# EAGLE design 20230322 (EAGLE 6.6.0)

## Sheet 1 of 4
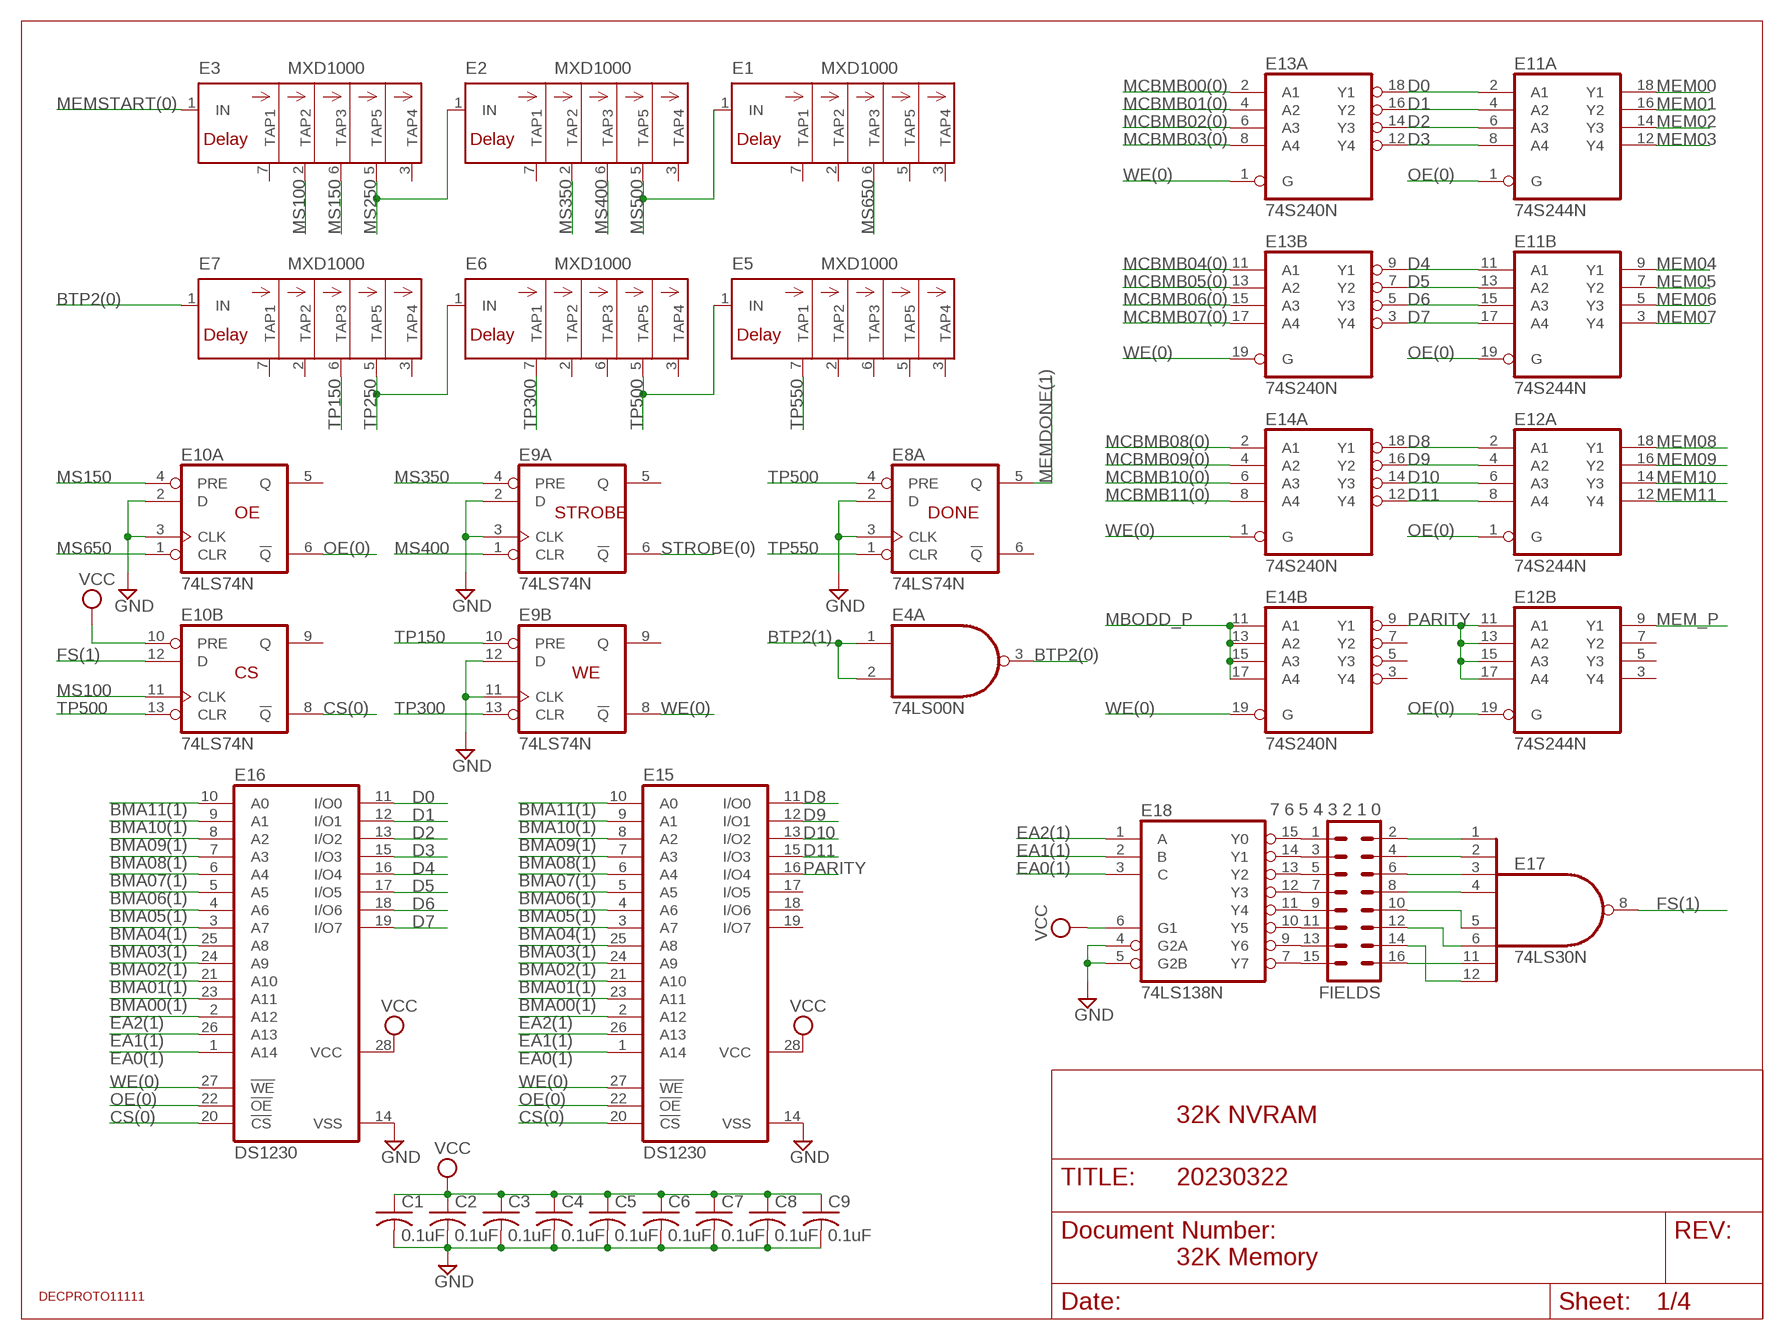
[diagram p0: schematic, sheet 1]

### Parts
C1  0.1uF  C-US050-025X075  [C050-025X075]
C2  0.1uF  C-US050-025X075  [C050-025X075]
C3  0.1uF  C-US050-025X075  [C050-025X075]
C4  0.1uF  C-US050-025X075  [C050-025X075]
C5  0.1uF  C-US050-025X075  [C050-025X075]
C6  0.1uF  C-US050-025X075  [C050-025X075]
C7  0.1uF  C-US050-025X075  [C050-025X075]
C8  0.1uF  C-US050-025X075  [C050-025X075]
C9  0.1uF  C-US050-025X075  [C050-025X075]
E1  MXD1000  [DIL08]
E2  MXD1000  [DIL08]
E3  MXD1000  [DIL08]
E4  74LS00N  [DIL14]
E5  MXD1000  [DIL08]
E6  MXD1000  [DIL08]
E7  MXD1000  [DIL08]
E8  74LS74N  [DIL14]
E9  74LS74N  [DIL14]
E10  74LS74N  [DIL14]
E11  74S244N  [DIL20]
E12  74S244N  [DIL20]
E13  74S240N  [DIL20]
E14  74S240N  [DIL20]
E15  DS1230  62256P  [DIL28-6]
E16  DS1230  62256P  [DIL28-6]
E17  74LS30N  [DIL14]
E18  74LS138N  [DIL16]
FIELDS  7 6 5 4 3 2 1 0  MA08-2  [MA08-2]
U$6  DECPROTO11111  [DECPROTO11111]

### Nets
BMA00(1): E15.23(A11) E16.23(A11) ; also sheet 2,3
BMA01(1): E15.21(A10) E16.21(A10) ; also sheet 2,3
BMA02(1): E15.24(A9) E16.24(A9) ; also sheet 2,3
BMA03(1): E15.25(A8) E16.25(A8) ; also sheet 2,3
BMA04(1): E15.3(A7) E16.3(A7) ; also sheet 2,3
BMA05(1): E15.4(A6) E16.4(A6) ; also sheet 2,3
BMA06(1): E15.5(A5) E16.5(A5) ; also sheet 2,3
BMA07(1): E15.6(A4) E16.6(A4) ; also sheet 2,3
BMA08(1): E15.7(A3) E16.7(A3) ; also sheet 2,3
BMA09(1): E15.8(A2) E16.8(A2) ; also sheet 2,3
BMA10(1): E15.9(A1) E16.9(A1) ; also sheet 2,3
BMA11(1): E15.10(A0) E16.10(A0) ; also sheet 2,3
BTP2(0): E4.3(A:O) E7.1(IN)
BTP2(1): E4.1(A:I0) E4.2(A:I1) ; also sheet 2
CS(0): E10.8(B:!Q) E15.20(!CS) E16.20(!CS) ; also sheet 3
D0: E11.2(A:A1) E13.18(A:Y1) E16.11(I/O0) ; also sheet 3
D1: E11.4(A:A2) E13.16(A:Y2) E16.12(I/O1) ; also sheet 3
D2: E11.6(A:A3) E13.14(A:Y3) E16.13(I/O2) ; also sheet 3
D3: E11.8(A:A4) E13.12(A:Y4) E16.15(I/O3) ; also sheet 3
D4: E11.11(B:A1) E13.9(B:Y1) E16.16(I/O4) ; also sheet 3
D5: E11.13(B:A2) E13.7(B:Y2) E16.17(I/O5) ; also sheet 3
D6: E11.15(B:A3) E13.5(B:Y3) E16.18(I/O6) ; also sheet 3
D7: E11.17(B:A4) E13.3(B:Y4) E16.19(I/O7) ; also sheet 3
D8: E12.2(A:A1) E14.18(A:Y1) E15.11(I/O0) ; also sheet 3
D9: E12.4(A:A2) E14.16(A:Y2) E15.12(I/O1) ; also sheet 3
D10: E12.6(A:A3) E14.14(A:Y3) E15.13(I/O2) ; also sheet 3
D11: E12.8(A:A4) E14.12(A:Y4) E15.15(I/O3) ; also sheet 3
EA0(1): E15.1(A14) E16.1(A14) E18.3(C) ; also sheet 2,3
EA1(1): E15.26(A13) E16.26(A13) E18.2(B) ; also sheet 2,3
EA2(1): E15.2(A12) E16.2(A12) E18.1(A) ; also sheet 2,3
FS(1): E10.12(B:D) E17.8(O) ; also sheet 3
GND [supply]: C1.2 C2.2 C3.2 C4.2 C5.2 C6.2 C7.2 C8.2 C9.2 E8.2(A:D) E8.3(A:CLK) E9.2(A:D) E9.3(A:CLK) E9.11(B:CLK) E9.12(B:D) E10.2(A:D) E10.3(A:CLK) E15.14(VSS) E16.14(VSS) E18.4(G2A) E18.5(G2B) ; also sheet 2,3
MBODD_P: E14.11(B:A1) E14.13(B:A2) E14.15(B:A3) E14.17(B:A4) ; also sheet 2,3
MCBMB00(0): E13.2(A:A1) ; also sheet 2,3
MCBMB01(0): E13.4(A:A2) ; also sheet 2,3
MCBMB02(0): E13.6(A:A3) ; also sheet 2,3
MCBMB03(0): E13.8(A:A4) ; also sheet 2
MCBMB04(0): E13.11(B:A1) ; also sheet 2
MCBMB05(0): E13.13(B:A2) ; also sheet 2
MCBMB06(0): E13.15(B:A3) ; also sheet 2
MCBMB07(0): E13.17(B:A4) ; also sheet 2
MCBMB08(0): E14.2(A:A1) ; also sheet 2
MCBMB09(0): E14.4(A:A2) ; also sheet 2
MCBMB10(0): E14.6(A:A3) ; also sheet 2
MCBMB11(0): E14.8(A:A4) ; also sheet 2
MEM00: E11.18(A:Y1) ; also sheet 2
MEM01: E11.16(A:Y2) ; also sheet 2
MEM02: E11.14(A:Y3) ; also sheet 2
MEM03: E11.12(A:Y4) ; also sheet 2
MEM04: E11.9(B:Y1) ; also sheet 2
MEM05: E11.7(B:Y2) ; also sheet 2
MEM06: E11.5(B:Y3) ; also sheet 2
MEM07: E11.3(B:Y4) ; also sheet 2
MEM08: E12.18(A:Y1) ; also sheet 2,3
MEM09: E12.16(A:Y2) ; also sheet 2,3
MEM10: E12.14(A:Y3) ; also sheet 2,3
MEM11: E12.12(A:Y4) ; also sheet 2,3
MEM_P: E12.9(B:Y1) ; also sheet 2
MEMDONE(1): E8.5(A:Q) ; also sheet 2
MEMSTART(0): E3.1(IN) ; also sheet 2
MS100: E3.2(TAP2) E10.11(B:CLK)
MS150: E3.6(TAP3) E10.4(A:PRE)
MS250: E2.1(IN) E3.5(TAP5)
MS350: E2.2(TAP2) E9.4(A:PRE)
MS400: E2.6(TAP3) E9.1(A:CLR)
MS500: E1.1(IN) E2.5(TAP5)
MS650: E1.6(TAP3) E10.1(A:CLR)
N$18: E18.15(Y0) FIELDS.1
N$19: E18.14(Y1) FIELDS.3
N$20: E18.13(Y2) FIELDS.5
N$21: E18.12(Y3) FIELDS.7
N$22: E18.11(Y4) FIELDS.9
N$23: E18.10(Y5) FIELDS.11
N$24: E18.9(Y6) FIELDS.13
N$25: E18.7(Y7) FIELDS.15
N$26: E17.4(I3) FIELDS.8
N$27: E17.3(I2) FIELDS.6
N$28: E17.2(I1) FIELDS.4
N$29: E17.1(I0) FIELDS.2
N$30: E17.5(I4) FIELDS.10
N$31: E17.6(I5) FIELDS.12
N$32: E17.12(I7) FIELDS.14
N$33: E17.11(I6) FIELDS.16
OE(0): E10.6(A:!Q) E11.1(A:G) E11.19(B:G) E12.1(A:G) E12.19(B:G) E15.22(!OE) E16.22(!OE) ; also sheet 3
PARITY: E12.11(B:A1) E12.13(B:A2) E12.15(B:A3) E12.17(B:A4) E14.9(B:Y1) E15.16(I/O4) ; also sheet 3
STROBE(0): E9.6(A:!Q) ; also sheet 2
TP150: E7.6(TAP3) E9.10(B:PRE)
TP250: E6.1(IN) E7.5(TAP5)
TP300: E6.7(TAP1) E9.13(B:CLR)
TP500: E5.1(IN) E6.5(TAP5) E8.4(A:PRE) E10.13(B:CLR)
TP550: E5.7(TAP1) E8.1(A:CLR)
VCC [supply]: C1.1 C2.1 C3.1 C4.1 C5.1 C6.1 C7.1 C8.1 C9.1 E10.10(B:PRE) E15.28(VCC) E16.28(VCC) E18.6(G1) ; also sheet 2
WE(0): E9.8(B:!Q) E13.1(A:G) E13.19(B:G) E14.1(A:G) E14.19(B:G) E15.27(!WE) E16.27(!WE) ; also sheet 3
Unconnected: E1.2(TAP2) E1.3(TAP4) E1.5(TAP5) E1.7(TAP1) E2.3(TAP4) E2.7(TAP1) E3.3(TAP4) E3.7(TAP1) E4.4(B:I0) E4.5(B:I1) E4.6(B:O) E4.8(C:O) E4.9(C:I0) E4.10(C:I1) E4.11(D:O) E4.12(D:I0) E4.13(D:I1) E5.2(TAP2) E5.3(TAP4) E5.5(TAP5) E5.6(TAP3) E6.2(TAP2) E6.3(TAP4) E6.6(TAP3) E7.2(TAP2) E7.3(TAP4) E7.7(TAP1) E8.6(A:!Q) E8.8(B:!Q) E8.9(B:Q) E8.10(B:PRE) E8.11(B:CLK) E8.12(B:D) E8.13(B:CLR) E9.5(A:Q) E9.9(B:Q) E10.5(A:Q) E10.9(B:Q) E12.3(B:Y4) E12.5(B:Y3) E12.7(B:Y2) E14.3(B:Y4) E14.5(B:Y3) E14.7(B:Y2) E15.17(I/O5) E15.18(I/O6) E15.19(I/O7)

### Notes on the sheet
- OE | STROBE | DONE
- CS | WE
- 32K NVRAM
- 32K Memory

## Sheet 2 of 4
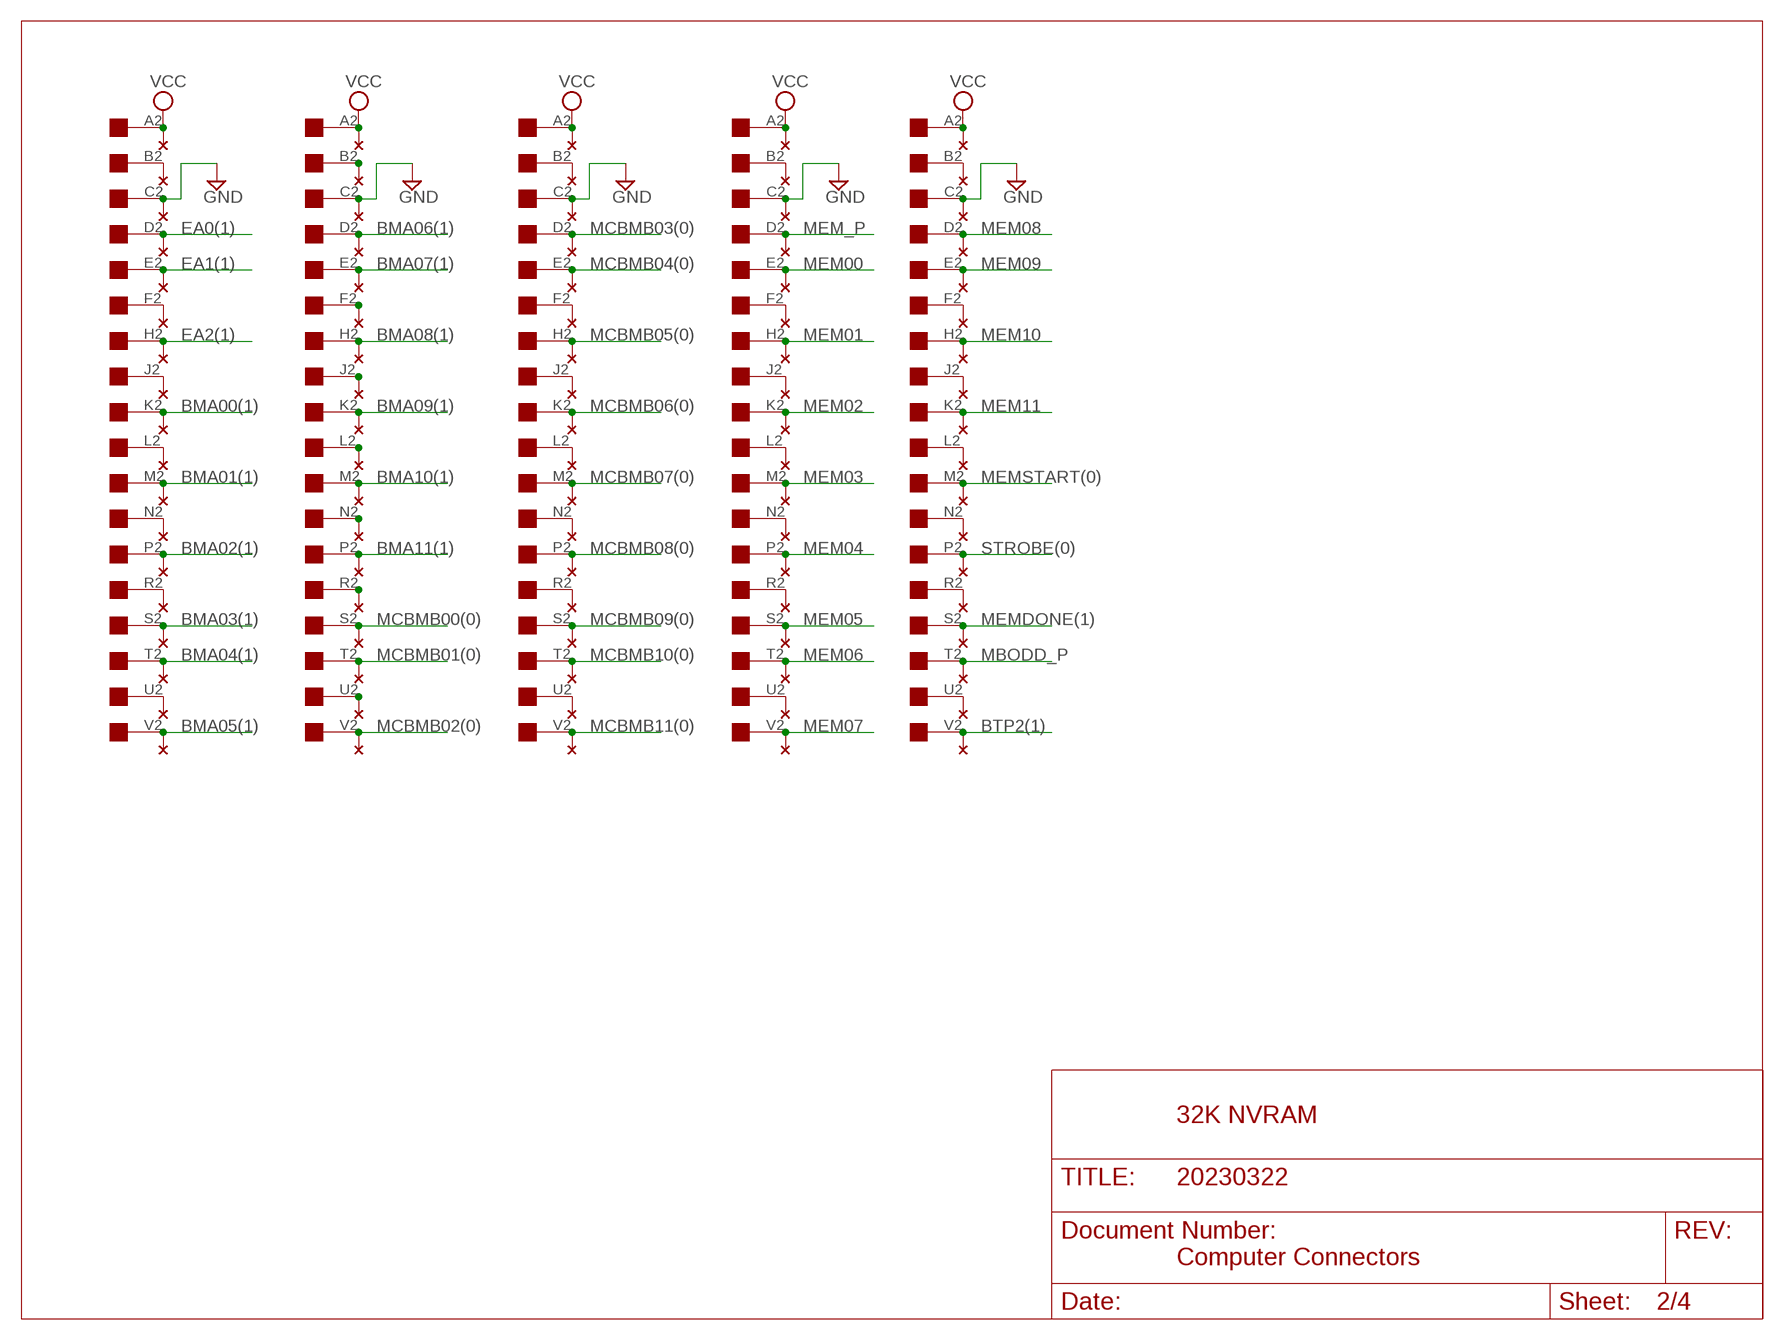
[diagram p1: schematic, sheet 2]

### Parts
H01  EDGE-1  [EDGE-CON1]
H02  EDGE-1  [EDGE-CON1]
H03  EDGE-1  [EDGE-CON1]
H04  EDGE-1  [EDGE-CON1]
H05  EDGE-1  [EDGE-CON1]
U$1  THRU-HOLE2  [THRU-HOLEB]
U$2  THRU-HOLE2  [THRU-HOLEB]
U$3  THRU-HOLE2  [THRU-HOLEB]
U$4  THRU-HOLE2  [THRU-HOLEB]
U$5  THRU-HOLE2  [THRU-HOLEB]

### Nets
BMA00(1): H01.K2 U$1.K2 ; also sheet 1,3
BMA01(1): H01.M2 U$1.M2 ; also sheet 1,3
BMA02(1): H01.P2 U$1.P2 ; also sheet 1,3
BMA03(1): H01.S2 U$1.S2 ; also sheet 1,3
BMA04(1): H01.T2 U$1.T2 ; also sheet 1,3
BMA05(1): H01.V2 U$1.V2 ; also sheet 1,3
BMA06(1): H02.D2 U$2.D2 ; also sheet 1,3
BMA07(1): H02.E2 U$2.E2 ; also sheet 1,3
BMA08(1): H02.H2 U$2.H2 ; also sheet 1,3
BMA09(1): H02.K2 U$2.K2 ; also sheet 1,3
BMA10(1): H02.M2 U$2.M2 ; also sheet 1,3
BMA11(1): H02.P2 U$2.P2 ; also sheet 1,3
BTP2(1): H05.V2 U$5.V2 ; also sheet 1
EA0(1): H01.D2 U$1.D2 ; also sheet 1,3
EA1(1): H01.E2 U$1.E2 ; also sheet 1,3
EA2(1): H01.H2 U$1.H2 ; also sheet 1,3
GND [supply]: H01.C2 H02.C2 H03.C2 H04.C2 H05.C2 U$1.C2 U$2.C2 U$3.C2 U$4.C2 U$5.C2 ; also sheet 1,3
MBODD_P: H05.T2 U$5.T2 ; also sheet 1,3
MCBMB00(0): H02.S2 U$2.S2 ; also sheet 1,3
MCBMB01(0): H02.T2 U$2.T2 ; also sheet 1,3
MCBMB02(0): H02.V2 U$2.V2 ; also sheet 1,3
MCBMB03(0): H03.D2 U$3.D2 ; also sheet 1
MCBMB04(0): H03.E2 U$3.E2 ; also sheet 1
MCBMB05(0): H03.H2 U$3.H2 ; also sheet 1
MCBMB06(0): H03.K2 U$3.K2 ; also sheet 1
MCBMB07(0): H03.M2 U$3.M2 ; also sheet 1
MCBMB08(0): H03.P2 U$3.P2 ; also sheet 1
MCBMB09(0): H03.S2 U$3.S2 ; also sheet 1
MCBMB10(0): H03.T2 U$3.T2 ; also sheet 1
MCBMB11(0): H03.V2 U$3.V2 ; also sheet 1
MEM00: H04.E2 U$4.E2 ; also sheet 1
MEM01: H04.H2 U$4.H2 ; also sheet 1
MEM02: H04.K2 U$4.K2 ; also sheet 1
MEM03: H04.M2 U$4.M2 ; also sheet 1
MEM04: H04.P2 U$4.P2 ; also sheet 1
MEM05: H04.S2 U$4.S2 ; also sheet 1
MEM06: H04.T2 U$4.T2 ; also sheet 1
MEM07: H04.V2 U$4.V2 ; also sheet 1
MEM08: H05.D2 U$5.D2 ; also sheet 1,3
MEM09: H05.E2 U$5.E2 ; also sheet 1,3
MEM10: H05.H2 U$5.H2 ; also sheet 1,3
MEM11: H05.K2 U$5.K2 ; also sheet 1,3
MEM_P: H04.D2 U$4.D2 ; also sheet 1
MEMDONE(1): H05.S2 U$5.S2 ; also sheet 1
MEMSTART(0): H05.M2 U$5.M2 ; also sheet 1
N$1: H01.L2 U$1.L2
N$3: H01.N2 U$1.N2
N$5: H01.R2 U$1.R2
N$7: H02.L2 U$2.L2
N$8: H02.N2 U$2.N2
N$9: H01.J2 U$1.J2
N$10: H02.R2 U$2.R2
N$11: H01.F2 U$1.F2
N$12: H02.J2 U$2.J2
N$13: H02.F2 U$2.F2
N$14: H02.U2 U$2.U2
N$15: H01.U2 U$1.U2
N$16: H02.B2 U$2.B2
N$17: H01.B2 U$1.B2
N$44: H04.J2 U$4.J2
N$45: H04.L2 U$4.L2
N$46: H04.N2 U$4.N2
N$57: H03.J2 U$3.J2
N$58: H03.L2 U$3.L2
N$59: H03.N2 U$3.N2
N$60: H03.F2 U$3.F2
N$61: H03.R2 U$3.R2
N$62: H03.B2 U$3.B2
N$63: H03.U2 U$3.U2
N$87: H05.J2 U$5.J2
N$88: H05.L2 U$5.L2
N$89: H05.N2 U$5.N2
N$90: H05.F2 U$5.F2
N$91: H05.R2 U$5.R2
N$92: H05.B2 U$5.B2
N$93: H05.U2 U$5.U2
N$112: H04.F2 U$4.F2
N$113: H04.R2 U$4.R2
N$114: H04.B2 U$4.B2
N$115: H04.U2 U$4.U2
STROBE(0): H05.P2 U$5.P2 ; also sheet 1
VCC [supply]: H01.A2 H02.A2 H03.A2 H04.A2 H05.A2 U$1.A2 U$2.A2 U$3.A2 U$4.A2 U$5.A2 ; also sheet 1
Unconnected: U$1.A1 U$1.B1 U$1.C1 U$1.D1 U$1.E1 U$1.F1 U$1.H1 U$1.J1 U$1.K1 U$1.L1 U$1.M1 U$1.N1 U$1.P1 U$1.R1 U$1.S1 U$1.T1 U$1.U1 U$1.V1 U$2.A1 U$2.B1 U$2.C1 U$2.D1 U$2.E1 U$2.F1 U$2.H1 U$2.J1 U$2.K1 U$2.L1 U$2.M1 U$2.N1 U$2.P1 U$2.R1 U$2.S1 U$2.T1 U$2.U1 U$2.V1 U$3.A1 U$3.B1 U$3.C1 U$3.D1 U$3.E1 U$3.F1 U$3.H1 U$3.J1 U$3.K1 U$3.L1 U$3.M1 U$3.N1 U$3.P1 U$3.R1 U$3.S1 U$3.T1 U$3.U1 U$3.V1 U$4.A1 U$4.B1 U$4.C1 U$4.D1 U$4.E1 U$4.F1 U$4.H1 U$4.J1 U$4.K1 U$4.L1 U$4.M1 U$4.N1 U$4.P1 U$4.R1 U$4.S1 U$4.T1 U$4.U1 U$4.V1 U$5.A1 U$5.B1 U$5.C1 U$5.D1 U$5.E1 U$5.F1 U$5.H1 U$5.J1 U$5.K1 U$5.L1 U$5.M1 U$5.N1 U$5.P1 U$5.R1 U$5.S1 U$5.T1 U$5.U1 U$5.V1

### Notes on the sheet
- 32K NVRAM
- Computer Connectors

## Sheet 3 of 4
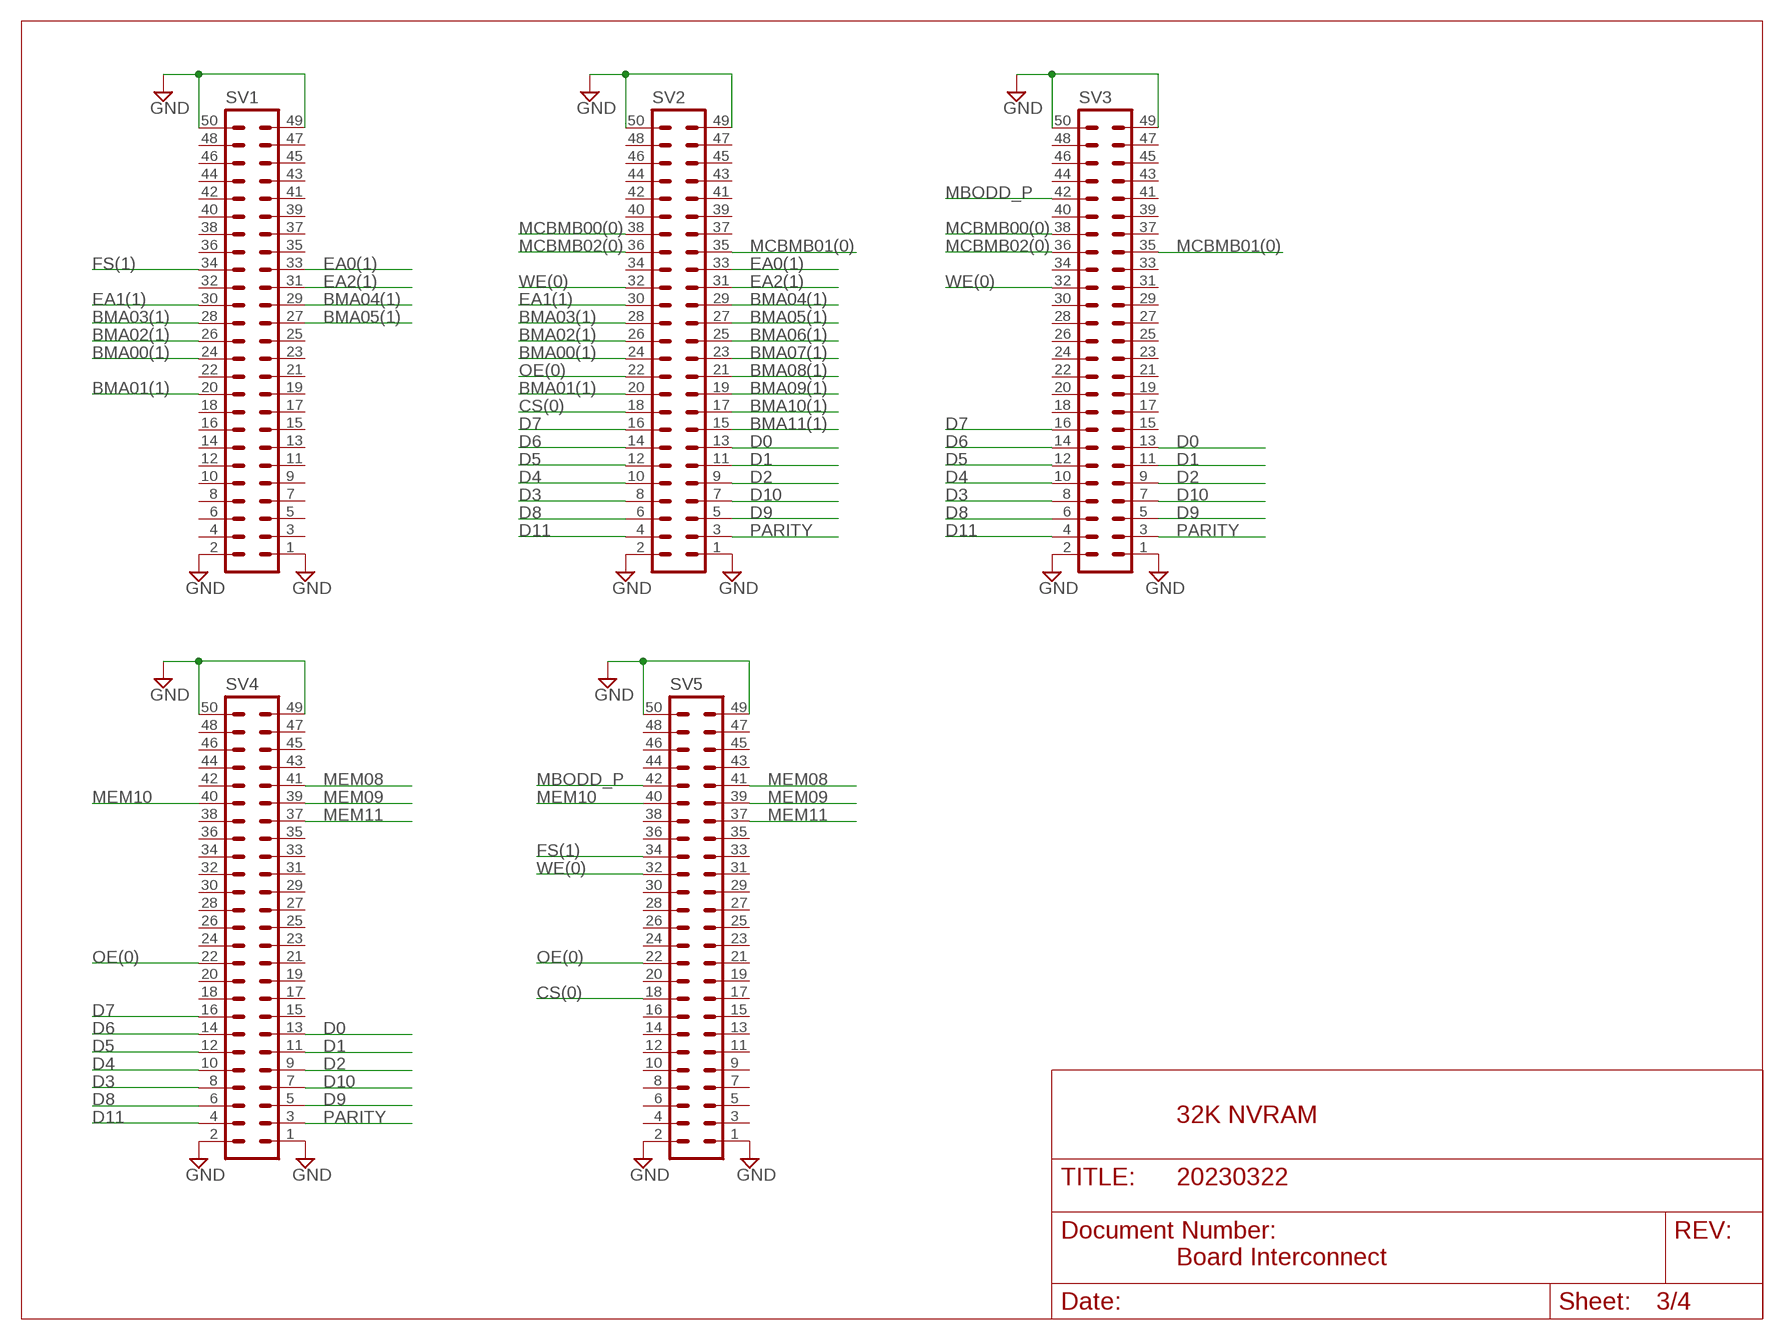
[diagram p2: schematic, sheet 3]

### Parts
SV1  ML50L  [ML50L]
SV2  ML50L  [ML50L]
SV3  ML50L  [ML50L]
SV4  ML50L  [ML50L]
SV5  ML50L  [ML50L]

### Nets
BMA00(1): SV1.24 SV2.24 ; also sheet 1,2
BMA01(1): SV1.20 SV2.20 ; also sheet 1,2
BMA02(1): SV1.26 SV2.26 ; also sheet 1,2
BMA03(1): SV1.28 SV2.28 ; also sheet 1,2
BMA04(1): SV1.29 SV2.29 ; also sheet 1,2
BMA05(1): SV1.27 SV2.27 ; also sheet 1,2
BMA06(1): SV2.25 ; also sheet 1,2
BMA07(1): SV2.23 ; also sheet 1,2
BMA08(1): SV2.21 ; also sheet 1,2
BMA09(1): SV2.19 ; also sheet 1,2
BMA10(1): SV2.17 ; also sheet 1,2
BMA11(1): SV2.15 ; also sheet 1,2
CS(0): SV2.18 SV5.18 ; also sheet 1
D0: SV2.13 SV3.13 SV4.13 ; also sheet 1
D1: SV2.11 SV3.11 SV4.11 ; also sheet 1
D2: SV2.9 SV3.9 SV4.9 ; also sheet 1
D3: SV2.8 SV3.8 SV4.8 ; also sheet 1
D4: SV2.10 SV3.10 SV4.10 ; also sheet 1
D5: SV2.12 SV3.12 SV4.12 ; also sheet 1
D6: SV2.14 SV3.14 SV4.14 ; also sheet 1
D7: SV2.16 SV3.16 SV4.16 ; also sheet 1
D8: SV2.6 SV3.6 SV4.6 ; also sheet 1
D9: SV2.5 SV3.5 SV4.5 ; also sheet 1
D10: SV2.7 SV3.7 SV4.7 ; also sheet 1
D11: SV2.4 SV3.4 SV4.4 ; also sheet 1
EA0(1): SV1.33 SV2.33 ; also sheet 1,2
EA1(1): SV1.30 SV2.30 ; also sheet 1,2
EA2(1): SV1.31 SV2.31 ; also sheet 1,2
FS(1): SV1.34 SV5.34 ; also sheet 1
GND [supply]: SV1.1 SV1.2 SV1.49 SV1.50 SV2.1 SV2.2 SV2.49 SV2.50 SV3.1 SV3.2 SV3.49 SV3.50 SV4.1 SV4.2 SV4.49 SV4.50 SV5.1 SV5.2 SV5.49 SV5.50 ; also sheet 1,2
MBODD_P: SV3.42 SV5.42 ; also sheet 1,2
MCBMB00(0): SV2.38 SV3.38 ; also sheet 1,2
MCBMB01(0): SV2.35 SV3.35 ; also sheet 1,2
MCBMB02(0): SV2.36 SV3.36 ; also sheet 1,2
MEM08: SV4.41 SV5.41 ; also sheet 1,2
MEM09: SV4.39 SV5.39 ; also sheet 1,2
MEM10: SV4.40 SV5.40 ; also sheet 1,2
MEM11: SV4.37 SV5.37 ; also sheet 1,2
OE(0): SV2.22 SV4.22 SV5.22 ; also sheet 1
PARITY: SV2.3 SV3.3 SV4.3 ; also sheet 1
WE(0): SV2.32 SV3.32 SV5.32 ; also sheet 1
Unconnected: SV1.3 SV1.4 SV1.5 SV1.6 SV1.7 SV1.8 SV1.9 SV1.10 SV1.11 SV1.12 SV1.13 SV1.14 SV1.15 SV1.16 SV1.17 SV1.18 SV1.19 SV1.21 SV1.22 SV1.23 SV1.25 SV1.32 SV1.35 SV1.36 SV1.37 SV1.38 SV1.39 SV1.40 SV1.41 SV1.42 SV1.43 SV1.44 SV1.45 SV1.46 SV1.47 SV1.48 SV2.34 SV2.37 SV2.39 SV2.40 SV2.41 SV2.42 SV2.43 SV2.44 SV2.45 SV2.46 SV2.47 SV2.48 SV3.15 SV3.17 SV3.18 SV3.19 SV3.20 SV3.21 SV3.22 SV3.23 SV3.24 SV3.25 SV3.26 SV3.27 SV3.28 SV3.29 SV3.30 SV3.31 SV3.33 SV3.34 SV3.37 SV3.39 SV3.40 SV3.41 SV3.43 SV3.44 SV3.45 SV3.46 SV3.47 SV3.48 SV4.15 SV4.17 SV4.18 SV4.19 SV4.20 SV4.21 SV4.23 SV4.24 SV4.25 SV4.26 SV4.27 SV4.28 SV4.29 SV4.30 SV4.31 SV4.32 SV4.33 SV4.34 SV4.35 SV4.36 SV4.38 SV4.42 SV4.43 SV4.44 SV4.45 SV4.46 SV4.47 SV4.48 SV5.3 SV5.4 SV5.5 SV5.6 SV5.7 SV5.8 SV5.9 SV5.10 SV5.11 SV5.12 SV5.13 SV5.14 SV5.15 SV5.16 SV5.17 SV5.19 SV5.20 SV5.21 SV5.23 SV5.24 SV5.25 SV5.26 SV5.27 SV5.28 SV5.29 SV5.30 SV5.31 SV5.33 SV5.35 SV5.36 SV5.38 SV5.43 SV5.44 SV5.45 SV5.46 SV5.47 SV5.48

### Notes on the sheet
- 32K NVRAM
- Board Interconnect

## Sheet 4 of 4
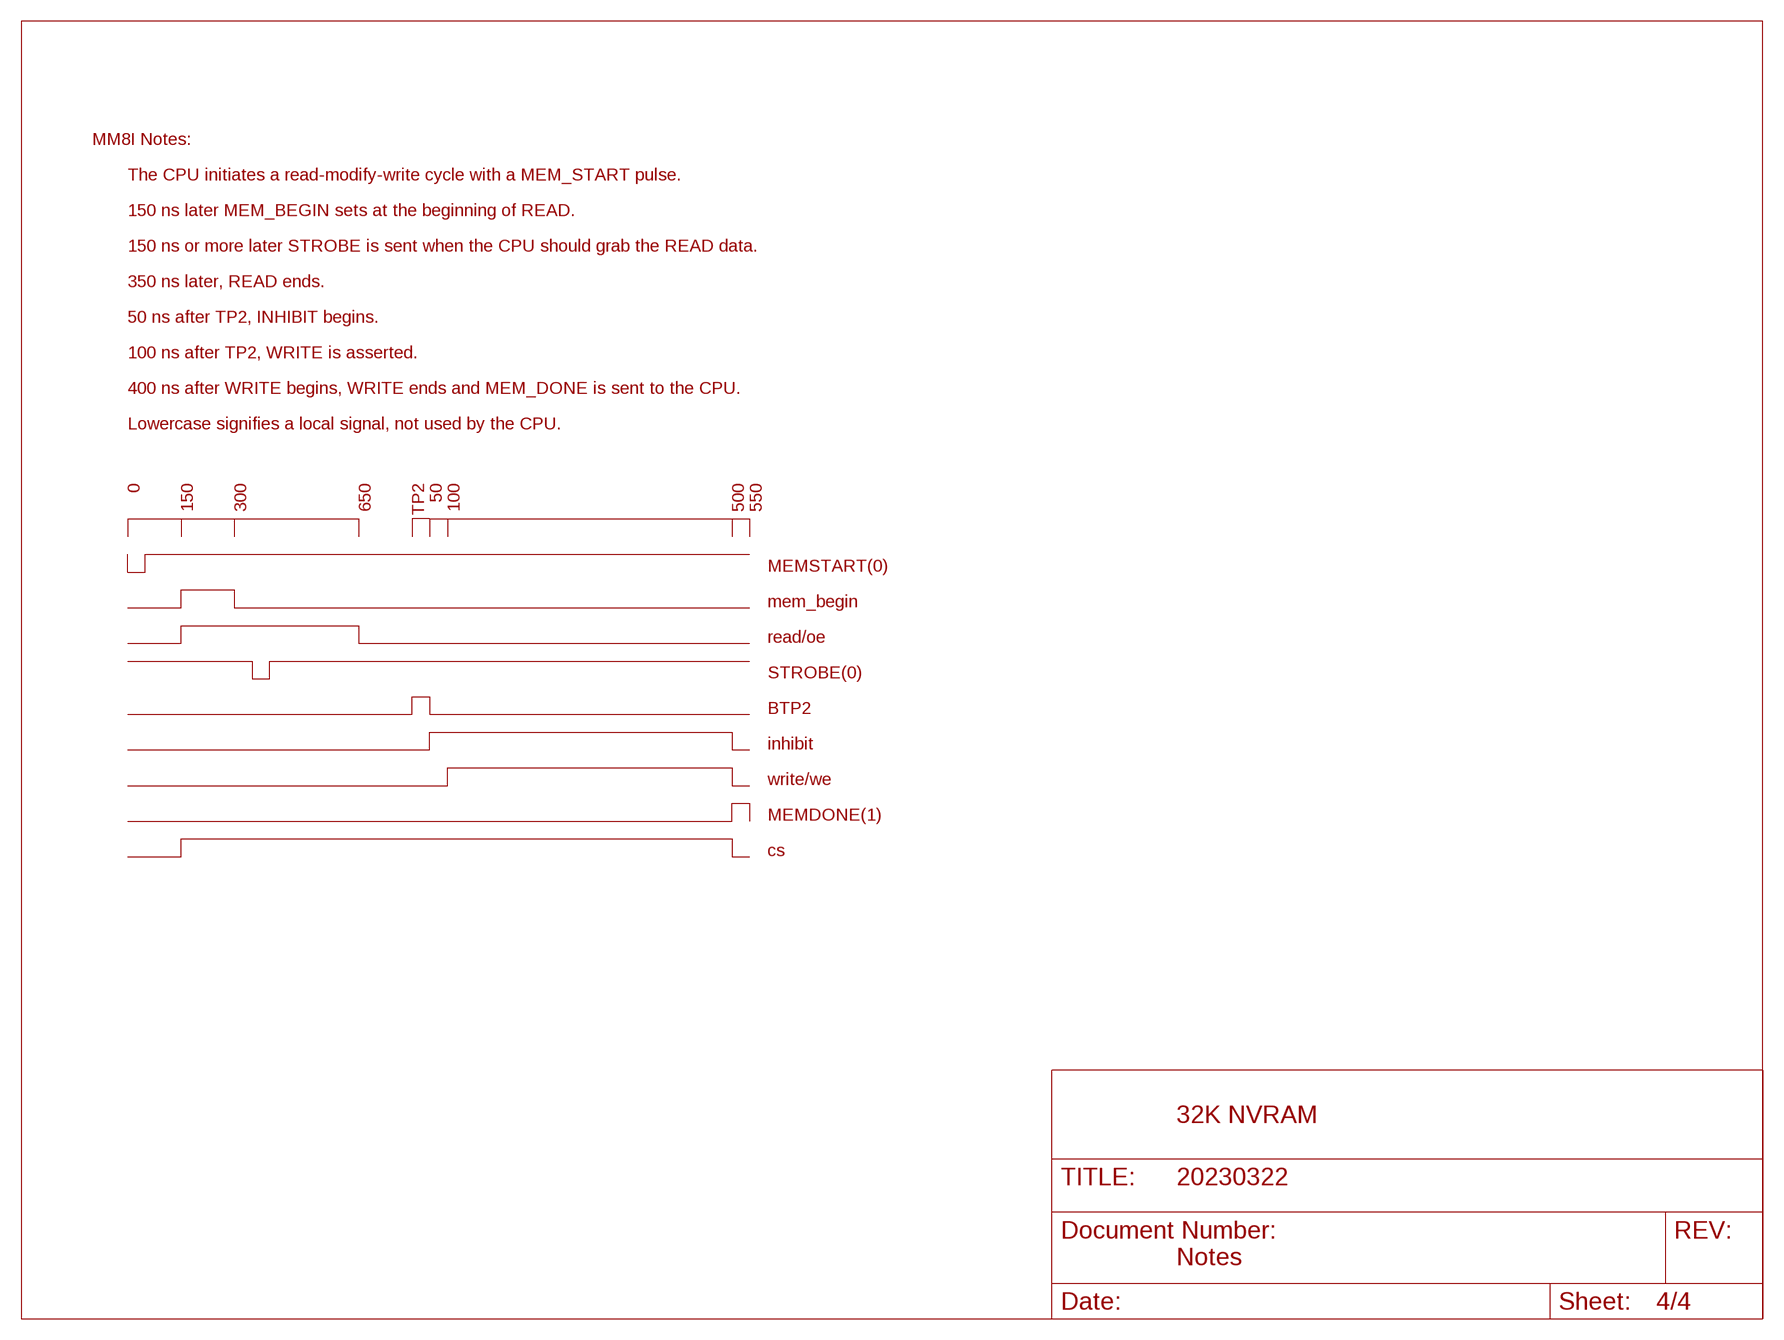
[diagram p3: schematic, sheet 4]

### Notes on the sheet
- MM8I Notes:
- The CPU initiates a read-modify-write cycle with a MEM_START pulse.
- 150 ns later MEM_BEGIN sets at the beginning of READ.
- 150 ns or more later STROBE is sent when the CPU should grab the READ data.
- 350 ns later, READ ends.
- 50 ns after TP2, INHIBIT begins.
- 100 ns after TP2, WRITE is asserted.
- 400 ns after WRITE begins, WRITE ends and MEM_DONE is sent to the CPU.
- Lowercase signifies a local signal, not used by the CPU.
- 0 | 150 | 300 | 650 | TP2 | 50 | 100 | 500 | 550
- MEMSTART(0)
- mem_begin
- read/oe
- STROBE(0)
- BTP2
- inhibit
- write/we
- MEMDONE(1)
- cs
- 32K NVRAM
- Notes

## Power pins joined to a net without a drawn wire
GND: E1.4(GND) E2.4(GND) E3.4(GND) E4.7(P:GND) E5.4(GND) E6.4(GND) E7.4(GND) E8.7(P:GND) E9.7(P:GND) E10.7(P:GND) E11.10(P:GND) E12.10(P:GND) E13.10(P:GND) E14.10(P:GND) E17.7(GND) E18.8(GND)
VCC: E1.8(VCC) E2.8(VCC) E3.8(VCC) E4.14(P:VCC) E5.8(VCC) E6.8(VCC) E7.8(VCC) E8.14(P:VCC) E9.14(P:VCC) E10.14(P:VCC) E11.20(P:VCC) E12.20(P:VCC) E13.20(P:VCC) E14.20(P:VCC) E17.14(VCC) E18.16(VCC)

## Library data of the parts
C1-C9 = rcl:C-US: CAPACITOR, American symbol
E1-E3 E5-E7 = maxim:MXD1000: DELAY LINE; OC_FARNELL: unknown; OC_NEWARK: unknown
E4 = 74xx-us:74*00: Quad 2-input NAND gate
E8-E10 = 74xx-us:74*74: Dual D type positive edge triggered FLIP FLOP, preset and clear
E11 E12 = 74xx-us:74*244: Octal BUFFER and LINE DRIVER, 3-state
E13 E14 = 74xx-us:74*240: Octal BUFFER and LINE DRIVER, 3-state
E15 E16 = memory-hitachi:62256P: MEMORY; OC_FARNELL: unknown; OC_NEWARK: unknown
E17 = 74xx-us:74*30: 8-input NAND gate
E18 = 74xx-us:74*138: 3-line to 8-line DECODER/DEMULTIPLEXER
FIELDS = con-lstb:MA08-2: PIN HEADER; OC_FARNELL: unknown; OC_NEWARK: unknown
H01-H05 = dec-con:EDGE-1: Single-Sided DEC Edge Connector -- (side 2)
SV1-SV5 = con-ml:ML50L: HARTING; OC_FARNELL: unknown; OC_NEWARK: unknown
U$1-U$5 = dec-con:THRU-HOLE2: Thru-Hole addition to double-sided edge connector.
U$6 = dec-con:DECPROTO: Various small DEC boards stuck together with break-away tab routing.

## Net classes
1 supply: width 0.711 mm

## Board
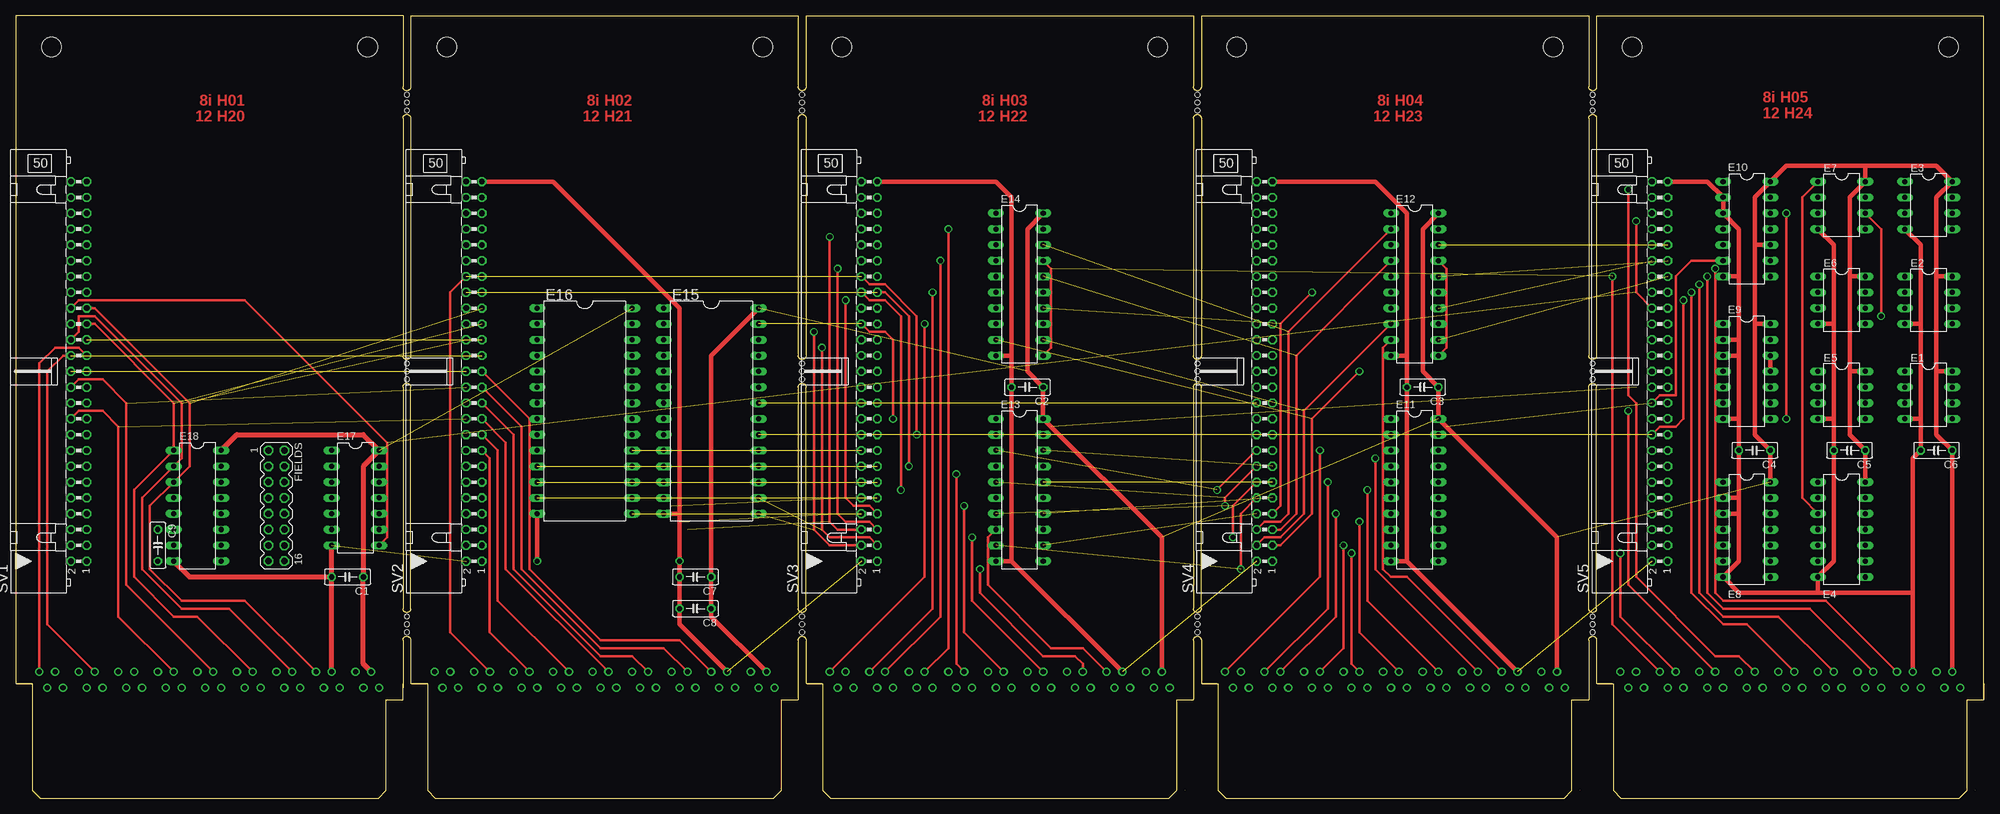
[diagram p4: board, top side]
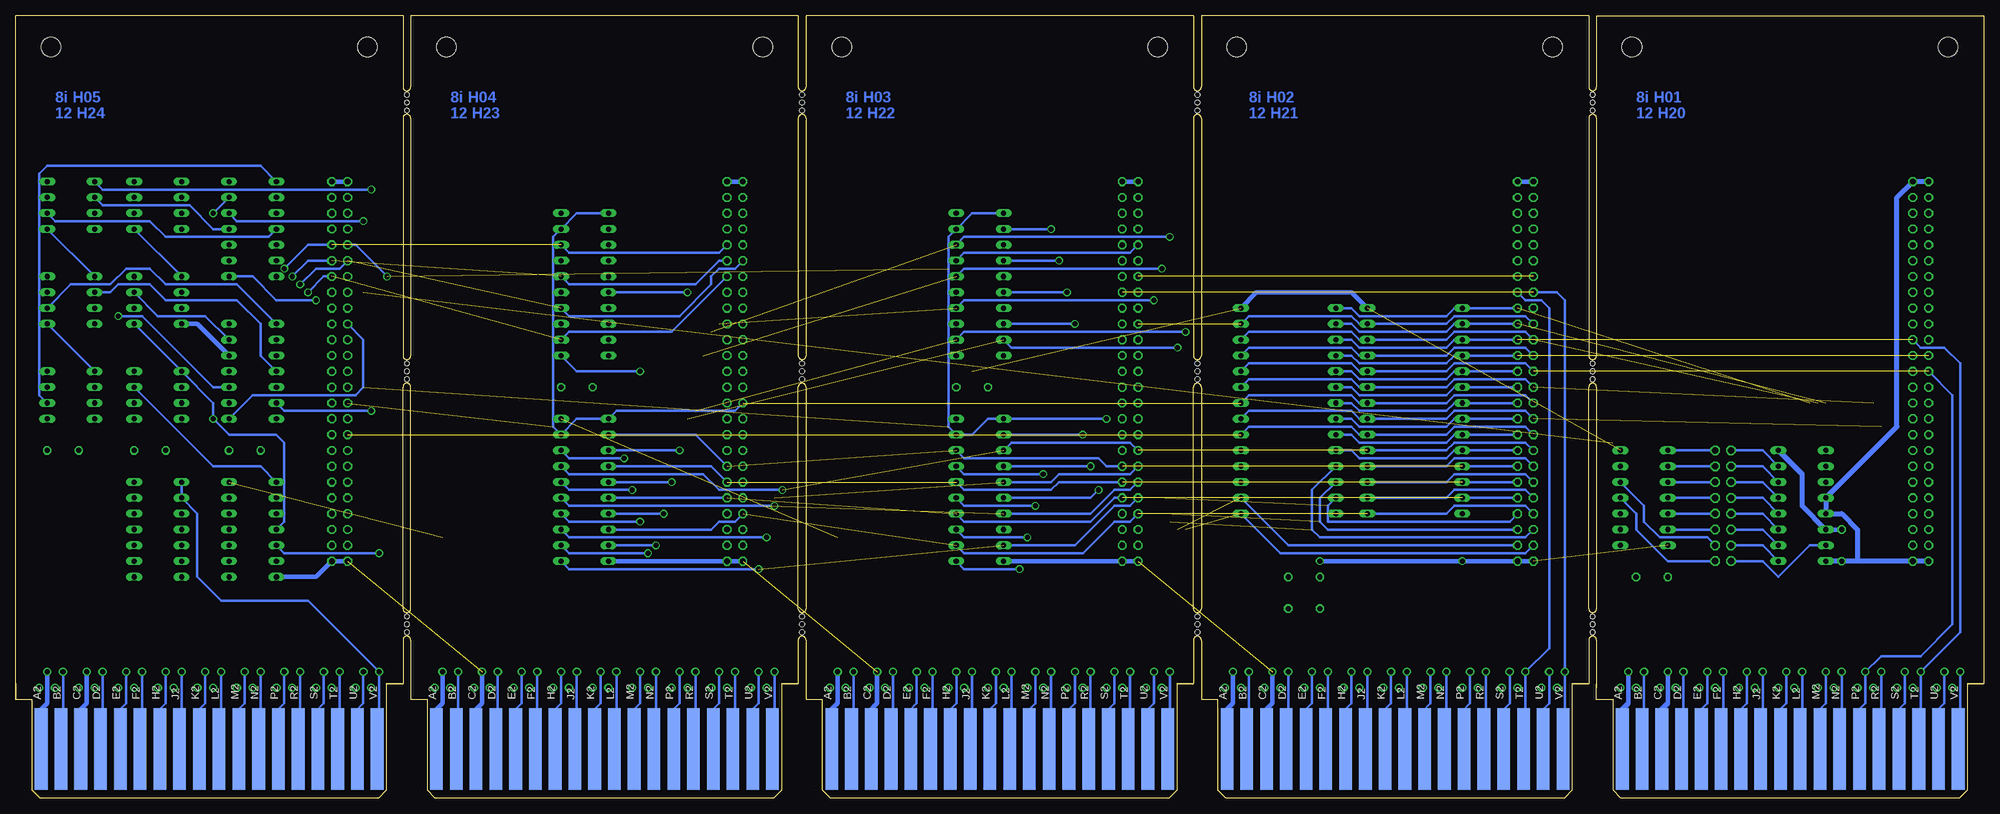
[diagram p5: board, bottom side, seen from below]

Size 316.23 x 125.73 mm. Coordinates in mm from the lower left corner, seen from the top.
Copper layers (1+16): Top 0.035mm / dielectric 1.5mm / Bottom 0.035mm
Design rules "16mils": minimum track width 16mil, minimum drill 32mil, track to track 15mil, track to pad 10mil, pad to pad 10mil, via to via 10mil, smd to smd 10mil, copper to edge 13mil, drill to drill 10mil, minimum pad ring 10mil, minimum via ring 8mil, stop-mask expansion 0mil, vias tented up to drill 0mil, thermal gap 10mil

### Footprints (pad centres in the part's own frame; a part is rotated, then mirrored left to right if it is on the bottom)
C050-025X075 = drill 0.813 octagon: 1 -2.54,0; 2 2.54,0
DIL08 = drill 0.813 long: 1 -3.81,-3.81; 2 -1.27,-3.81; 3 1.27,-3.81; 4 3.81,-3.81; 5 3.81,3.81; 6 1.27,3.81; 7 -1.27,3.81; 8 -3.81,3.81
DIL14 = drill 0.813 long: 1 -7.62,-3.81; 2 -5.08,-3.81; 3 -2.54,-3.81; 4 0,-3.81; 5 2.54,-3.81; 6 5.08,-3.81; 7 7.62,-3.81; 8 7.62,3.81; 9 5.08,3.81; 10 2.54,3.81; 11 0,3.81; 12 -2.54,3.81; 13 -5.08,3.81; 14 -7.62,3.81
DIL20 = drill 0.813 long: 1 -11.43,-3.81; 2 -8.89,-3.81; 3 -6.35,-3.81; 4 -3.81,-3.81; 5 -1.27,-3.81; 6 1.27,-3.81; 7 3.81,-3.81; 8 6.35,-3.81; 9 8.89,-3.81; 10 11.43,-3.81; 11 11.43,3.81; 12 8.89,3.81; 13 6.35,3.81; 14 3.81,3.81; 15 1.27,3.81; 16 -1.27,3.81; 17 -3.81,3.81; 18 -6.35,3.81; 19 -8.89,3.81; 20 -11.43,3.81
DIL28-6 = drill 0.813 long: 1 -16.51,-7.62; 2 -13.97,-7.62; 3 -11.43,-7.62; 4 -8.89,-7.62; 5 -6.35,-7.62; 6 -3.81,-7.62; 7 -1.27,-7.62; 8 1.27,-7.62; 9 3.81,-7.62; 10 6.35,-7.62; 11 8.89,-7.62; 12 11.43,-7.62; 13 13.97,-7.62; 14 16.51,-7.62; 15 16.51,7.62; 16 13.97,7.62; 17 11.43,7.62; 18 8.89,7.62; 19 6.35,7.62; 20 3.81,7.62; 21 1.27,7.62; 22 -1.27,7.62; 23 -3.81,7.62; 24 -6.35,7.62; 25 -8.89,7.62; 26 -11.43,7.62; 27 -13.97,7.62; 28 -16.51,7.62
DIL16 = drill 0.813 long: 1 -8.89,-3.81; 2 -6.35,-3.81; 3 -3.81,-3.81; 4 -1.27,-3.81; 5 1.27,-3.81; 6 3.81,-3.81; 7 6.35,-3.81; 8 8.89,-3.81; 9 8.89,3.81; 10 6.35,3.81; 11 3.81,3.81; 12 1.27,3.81; 13 -1.27,3.81; 14 -3.81,3.81; 15 -6.35,3.81; 16 -8.89,3.81
MA08-2 = drill 1.016 octagon: 1 -8.89,-1.27; 2 -8.89,1.27; 3 -6.35,-1.27; 4 -6.35,1.27; 5 -3.81,-1.27; 6 -3.81,1.27; 7 -1.27,-1.27; 8 -1.27,1.27; 9 1.27,-1.27; 10 1.27,1.27; 11 3.81,-1.27; 12 3.81,1.27; 13 6.35,-1.27; 14 6.35,1.27; 15 8.89,-1.27; 16 8.89,1.27
EDGE-CON1 = smd 13.106 x 2.032 bottom: A2 7.938,4.128; B2 7.938,7.303; C2 7.938,10.477; D2 7.938,13.652; E2 7.938,16.828; F2 7.938,20.003; H2 7.938,23.177; J2 7.938,26.352; K2 7.938,29.527; L2 7.938,32.703; M2 7.938,35.877; N2 7.938,39.053; P2 7.938,42.227; R2 7.938,45.403; S2 7.938,48.578; T2 7.938,51.752; U2 7.938,54.928; V2 7.938,58.102
ML50L = drill 0.914 octagon: 1 -30.48,-1.27; 2 -30.48,1.27; 3 -27.94,-1.27; 4 -27.94,1.27; 5 -25.4,-1.27; 6 -25.4,1.27; 7 -22.86,-1.27; 8 -22.86,1.27; 9 -20.32,-1.27; 10 -20.32,1.27; 11 -17.78,-1.27; 12 -17.78,1.27; 13 -15.24,-1.27; 14 -15.24,1.27; 15 -12.7,-1.27; 16 -12.7,1.27; 17 -10.16,-1.27; 18 -10.16,1.27; 19 -7.62,-1.27; 20 -7.62,1.27; 21 -5.08,-1.27; 22 -5.08,1.27; 23 -2.54,-1.27; 24 -2.54,1.27; 25 0,-1.27; 26 0,1.27; 27 2.54,-1.27; 28 2.54,1.27; 29 5.08,-1.27; 30 5.08,1.27; 31 7.62,-1.27; 32 7.62,1.27; 33 10.16,-1.27; 34 10.16,1.27; 35 12.7,-1.27; 36 12.7,1.27; 37 15.24,-1.27; 38 15.24,1.27; 39 17.78,-1.27; 40 17.78,1.27; 41 20.32,-1.27; 42 20.32,1.27; 43 22.86,-1.27; 44 22.86,1.27; 45 25.4,-1.27; 46 25.4,1.27; 47 27.94,-1.27; 48 27.94,1.27; 49 30.48,-1.27; 50 30.48,1.27
THRU-HOLEB = drill 0.813 pad 1.27: A1 17.78,3.81; A2 20.32,5.08; B1 17.78,6.35; B2 20.32,7.62; C1 17.78,10.16; C2 20.32,11.43; D1 17.78,12.7; D2 20.32,13.97; E1 17.78,16.51; E2 20.32,17.78; F1 17.78,19.05; F2 20.32,20.32; H1 17.78,22.86; H2 20.32,24.13; J1 17.78,25.4; J2 20.32,26.67; K1 17.78,29.21; K2 20.32,30.48; L1 17.78,31.75; L2 20.32,33.02; M1 17.78,35.56; M2 20.32,36.83; N1 17.78,38.1; N2 20.32,39.37; P1 17.78,41.91; P2 20.32,43.18; R1 17.78,44.45; R2 20.32,45.72; S1 17.78,48.26; S2 20.32,49.53; T1 17.78,50.8; T2 20.32,52.07; U1 17.78,54.61; U2 20.32,55.88; V1 17.78,57.15; V2 20.32,58.42
DECPROTO11111 = hole 3.175: 183.515,120.65; 132.715,120.65; 69.266,120.65; 120.066,120.65; 56.566,120.65; 5.766,120.65; 247.015,120.65; 196.215,120.65; 310.515,120.65; 259.715,120.65 | hole 0.813: 62.865,69.85; 62.865,68.58; 62.865,67.31; 62.865,26.67; 62.865,27.94; 62.865,29.21; 62.865,113.03; 62.865,110.49; 62.865,111.76; 126.365,69.85; 126.365,68.58; 126.365,67.31; 126.365,26.67; 126.365,27.94; 126.365,29.21; 126.365,113.03; 126.365,110.49; 126.365,111.76; 189.865,26.67; 189.865,27.94; 189.865,29.21; 189.865,67.31; 189.865,68.58; 189.865,69.85; 189.865,110.49; 189.865,111.76; 189.865,113.03; 253.365,26.67; 253.365,27.94; 253.365,29.21; 253.365,67.31; 253.365,68.58; 253.365,69.85; 253.365,110.49; 253.365,111.76; 253.365,113.03

### Placement (x,y rotation side)
C1  53.34,35.56 180 top
C2  162.56,66.04 180 top
C3  226.06,66.04 180 top
C4  279.4,55.88 180 top
C5  294.64,55.88 180 top
C6  308.61,55.88 180 top
C7  109.22,35.56 180 top
C8  109.22,30.48 180 top
C9  22.86,40.64 270 top
E1  307.34,64.77 270 top
E2  307.34,80.01 270 top
E3  307.34,95.25 270 top
E4  293.37,43.18 270 top
E5  293.37,64.77 270 top
E6  293.37,80.01 270 top
E7  293.37,95.25 270 top
E8  278.13,43.18 270 top
E9  278.13,68.58 270 top
E10  278.13,91.44 270 top
E11  224.79,49.53 270 top
E12  224.79,82.55 270 top
E13  161.29,49.53 270 top
E14  161.29,82.55 270 top
E15  111.76,62.23 270 top
E16  91.44,62.23 270 top
E17  54.61,48.26 270 top
E18  29.21,46.99 270 top
FIELDS  41.91,46.99 270 top
H01  62.23,0 90 top
H02  125.73,0 90 top
H03  189.23,0 90 top
H04  252.73,0 90 top
H05  316.23,0 90 top
SV1  10.16,68.58 90 top
SV2  73.66,68.58 90 top
SV3  137.16,68.58 90 top
SV4  200.66,68.58 90 top
SV5  264.16,68.58 90 top
U$1  62.23,0 90 top
U$2  125.73,0 90 top
U$3  189.23,0 90 top
U$4  252.73,0 90 top
U$5  316.23,0 90 top
U$6  0,0 0 top

### Tracks (layer width: path | path; a pad name or v marks a point on that pad's centre or on a via)
BMA00(1)  (1 unrouted)
  Top 0.406: U$1.K2 17.78,34.29 17.78,63.5 13.97,67.31 10.16,67.31 SV1.24
  Bottom 0.406: H01.K2 32.7,8.57 33.02,8.89 33.02,13.97 31.75,15.24 U$1.K2 | E15.23 118.11,67.31 101.6,67.31 100.33,66.04 E16.23 86.36,66.04 85.09,67.31 73.66,67.31 SV2.24
BMA01(1)  (1 unrouted)
  Top 0.406: U$1.M2 16.51,29.21 16.51,59.69 13.97,62.23 10.16,62.23 SV1.20
  Bottom 0.406: H01.M2 26.35,8.57 26.67,8.89 26.67,13.97 25.4,15.24 U$1.M2 | E15.21 118.11,62.23 101.6,62.23 100.33,60.96 E16.21 86.36,60.96 85.09,62.23 73.66,62.23 SV2.20
BMA02(1)  (1 unrouted)
  Bottom 0.406: H01.P2 20,8.57 20.32,8.89 20.32,13.97 19.05,15.24 U$1.P2 16.51,22.86 10.16,22.86 5.08,27.94 5.08,64.77 SV1.26 | E15.24 118.11,69.85 101.6,69.85 100.33,68.58 E16.24 86.36,68.58 85.09,69.85 73.66,69.85 SV2.26
BMA03(1)  (1 unrouted)
  Top 0.406: U$1.S2 5.08,27.94 5.08,68.58 7.62,71.12 SV1.28
  Bottom 0.406: H01.S2 13.65,8.57 13.97,8.89 13.97,13.97 12.7,15.24 U$1.S2 | E15.25 118.11,72.39 101.6,72.39 100.33,71.12 E16.25 86.36,71.12 85.09,72.39 73.66,72.39 SV2.28
BMA04(1)  (1 unrouted)
  Bottom 0.406: H01.T2 10.48,8.57 10.16,8.89 U$1.T2 3.81,26.67 3.81,69.85 6.35,72.39 10.16,72.39 SV1.29 | E15.3 101.6,73.66 100.33,72.39 86.36,72.39 85.09,73.66 E16.3 SV2.29
BMA05(1)  (1 unrouted)
  Top 0.406: U$1.V2 3.81,69.85 6.35,72.39 10.16,72.39 SV1.27
  Bottom 0.406: H01.V2 4.13,8.57 3.81,8.89 U$1.V2 | E15.4 101.6,71.12 100.33,69.85 86.36,69.85 85.09,71.12 E16.4 SV2.27
BMA06(1)
  Top 0.406: U$2.D2 106.68,25.4 93.98,25.4 82.55,36.83 82.55,60.96 SV2.25
  Bottom 0.406: H02.D2 112.08,8.57 111.76,8.89 U$2.D2 | E15.5 101.6,68.58 100.33,67.31 86.36,67.31 85.09,68.58 E16.5 SV2.25
BMA07(1)
  Top 0.406: U$2.E2 104.14,24.13 93.98,24.13 81.28,36.83 81.28,59.69 SV2.23
  Bottom 0.406: H02.E2 108.9,8.57 109.22,8.89 109.22,13.97 107.95,15.24 U$2.E2 | E15.6 101.6,66.04 100.33,64.77 86.36,64.77 85.09,66.04 E16.6 SV2.23
BMA08(1)
  Top 0.406: U$2.H2 99.06,22.86 93.98,22.86 80.01,36.83 80.01,58.42 SV2.21
  Bottom 0.406: H02.H2 102.55,8.57 102.87,8.89 102.87,13.97 101.6,15.24 U$2.H2 | E15.7 101.6,63.5 100.33,62.23 86.36,62.23 85.09,63.5 E16.7 SV2.21
BMA09(1)
  Top 0.406: U$2.K2 78.74,36.83 78.74,57.15 SV2.19
  Bottom 0.406: H02.K2 96.2,8.57 96.52,8.89 96.52,13.97 95.25,15.24 U$2.K2 | E15.8 101.6,60.96 100.33,59.69 86.36,59.69 85.09,60.96 E16.8 SV2.19
BMA10(1)
  Top 0.406: U$2.M2 77.47,31.75 77.47,55.88 SV2.17
  Bottom 0.406: H02.M2 89.85,8.57 90.17,8.89 90.17,13.97 88.9,15.24 U$2.M2 | E15.9 101.6,58.42 100.33,57.15 86.36,57.15 85.09,58.42 E16.9 SV2.17
BMA11(1)
  Top 0.406: U$2.P2 76.2,26.67 76.2,54.61 SV2.15
  Bottom 0.406: H02.P2 83.82,7.62 83.82,13.97 82.55,15.24 U$2.P2 | E15.10 101.6,55.88 100.33,54.61 86.36,54.61 85.09,55.88 E16.10 SV2.15
BTP2(0)
  Top 0.406: E4.3 287.02,48.26 287.02,96.52 E7.1
BTP2(1)
  Bottom 0.406: H05.V2 258.13,8.57 257.81,8.89 U$5.V2 269.24,31.75 283.21,31.75 287.02,35.56 287.02,45.72 E4.2 E4.1
CS(0)  (via drill 0.81)  (1 unrouted)
  Top 0.406: SV5.18 264.16,59.69 266.7,59.69 267.97,60.96 v267.97,80.01
  Bottom 0.406: E15.20 118.11,59.69 101.6,59.69 100.33,58.42 E16.20 86.36,58.42 85.09,59.69 73.66,59.69 SV2.18 | E10.8 278.13,83.82 274.32,80.01 v267.97,80.01
D0  (2 unrouted)
  Bottom 0.406: E16.11 SV2.13 | SV3.13 140.97,53.34 142.24,54.61 163.83,54.61 E13.18 | E11.2 207.01,58.42 SV4.13
D1  (2 unrouted)
  Bottom 0.406: SV2.11 E16.12 | SV3.11 148.59,50.8 149.86,49.53 163.83,49.53 E13.16 | E11.4 204.47,53.34 SV4.11
D2  (2 unrouted)
  Bottom 0.406: SV2.9 E16.13 | SV3.9 139.7,48.26 143.51,44.45 163.83,44.45 E13.14 | E11.6 SV4.9
D3  (2 unrouted)
  Bottom 0.406: E16.15 86.36,45.72 85.09,46.99 73.66,46.99 SV2.8 | E13.12 163.83,39.37 144.78,39.37 139.7,44.45 137.16,44.45 SV3.8 | E11.8 204.47,43.18 203.2,44.45 200.66,44.45 SV4.8
D4  (via drill 0.81)  (2 unrouted)
  Top 0.406: SV4.10 196.85,45.72 v196.85,36.83
  Bottom 0.406: E16.16 86.36,48.26 85.09,49.53 73.66,49.53 SV2.10 | E13.9 146.05,40.64 139.7,46.99 137.16,46.99 SV3.10 | E11.11 227.33,36.83 v196.85,36.83
D5  (via drill 0.81)  (2 unrouted)
  Top 0.406: SV4.12 195.58,46.99 v195.58,41.91
  Bottom 0.406: E16.17 86.36,50.8 85.09,52.07 73.66,52.07 SV2.12 | SV3.12 137.16,49.53 139.7,49.53 143.51,45.72 E13.7 | E11.13 227.33,41.91 v195.58,41.91
D6  (via drill 0.81)  (2 unrouted)
  Top 0.406: SV4.14 194.31,48.26 v194.31,46.99
  Bottom 0.406: E16.18 86.36,53.34 85.09,54.61 73.66,54.61 SV2.14 | SV3.14 137.16,52.07 148.59,52.07 149.86,50.8 E13.5 | E11.15 227.33,46.99 v194.31,46.99
D7  (via drill 0.81)  (2 unrouted)
  Top 0.406: SV4.16 v193.04,49.53
  Bottom 0.406: E16.19 86.36,55.88 85.09,57.15 73.66,57.15 SV2.16 | SV3.16 137.16,57.15 156.21,57.15 E13.3 | E11.17 227.33,52.07 205.74,52.07 203.2,49.53 v193.04,49.53
D8  (via drill 0.81)  (2 unrouted)
  Top 0.406: SV3.6 132.08,43.18 130.81,44.45 v130.81,90.17 | SV4.6 200.66,44.45 203.2,44.45 204.47,45.72 204.47,74.93 E12.2
  Bottom 0.406: E15.11 107.95,49.53 107.95,43.18 106.68,41.91 73.66,41.91 SV2.6 | E14.18 163.83,90.17 v130.81,90.17
D9  (via drill 0.81)  (2 unrouted)
  Top 0.406: SV3.5 137.16,44.45 133.35,44.45 132.08,45.72 v132.08,85.09 | SV4.5 203.2,43.18 205.74,45.72 205.74,71.12 E12.4
  Bottom 0.406: E15.12 106.68,48.26 106.68,44.45 105.41,43.18 SV2.5 | E14.16 163.83,85.09 v132.08,85.09
D10  (via drill 0.81)  (2 unrouted)
  Top 0.406: SV3.7 137.16,46.99 134.62,46.99 133.35,48.26 v133.35,80.01 | SV4.7 203.2,46.99 203.2,76.2 v208.28,81.28
  Bottom 0.406: E15.13 105.41,46.99 105.41,44.45 76.2,44.45 SV2.7 | E14.14 163.83,80.01 v133.35,80.01 | v208.28,81.28 E12.6
D11  (via drill 0.81)  (2 unrouted)
  Top 0.406: SV3.4 130.81,40.64 128.27,43.18 v128.27,74.93 | SV4.4 200.66,41.91 203.2,41.91 207.01,45.72 207.01,62.23 E12.8
  Bottom 0.406: E15.15 113.03,39.37 73.66,39.37 SV2.4 | E14.12 163.83,74.93 v128.27,74.93
EA0(1)  (1 unrouted)
  Top 0.406: U$1.D2 36.83,31.75 26.67,31.75 21.59,36.83 21.59,46.99 E18.3 27.94,53.34 27.94,63.5 12.7,78.74 SV1.33
  Bottom 0.406: H01.D2 48.58,8.57 48.26,8.89 U$1.D2 | E15.1 101.6,78.74 100.33,77.47 86.36,77.47 85.09,78.74 E16.1 SV2.33
EA1(1)  (1 unrouted)
  Top 0.406: U$1.E2 34.29,30.48 26.67,30.48 20.32,36.83 20.32,48.26 E18.2 26.67,54.61 26.67,63.5 12.7,77.47 10.16,77.47 10.16,74.93 SV1.30
  Bottom 0.406: H01.E2 45.72,7.62 45.72,13.97 44.45,15.24 U$1.E2 | E15.26 118.11,74.93 101.6,74.93 100.33,73.66 E16.26 86.36,73.66 85.09,74.93 73.66,74.93 SV2.30
EA2(1)  (1 unrouted)
  Top 0.406: U$1.H2 29.21,29.21 25.4,29.21 19.05,35.56 19.05,49.53 E18.1 25.4,63.5 12.7,76.2 SV1.31
  Bottom 0.406: H01.H2 39.05,8.57 39.37,8.89 39.37,13.97 38.1,15.24 U$1.H2 | E15.2 101.6,76.2 100.33,74.93 86.36,74.93 85.09,76.2 E16.2 SV2.31
FS(1)  (via drill 0.81)  (1 unrouted)
  Top 0.406: SV1.34 10.16,80.01 36.83,80.01 59.69,57.15 59.69,41.91 E17.8 | SV5.34 260.35,81.28 v260.35,92.71
  Bottom 0.406: v260.35,92.71 280.67,92.71 E10.12
GND  (via drill 0.81)  (4 unrouted)
  Top 0.711: U$2.C2 106.68,27.94 C8.2 C7.2 v106.68,38.1 106.68,45.72 | SV2.49 86.36,99.06 106.68,78.74 106.68,45.72 | E16.14 v83.82,38.1 | E1.4 306.07,60.96 | 306.07,60.96 C6.2 304.8,54.61 304.8,33.02 | E5.4 292.1,60.96 | 292.1,60.96 C5.2 292.1,38.1 E4.7 289.56,33.02 | E7.4 292.1,88.9 292.1,76.2 | 292.1,76.2 292.1,60.96 | E6.4 292.1,76.2 | E2.4 306.07,76.2 | 306.07,76.2 306.07,60.96 | E3.4 306.07,88.9 306.07,76.2 | 289.56,33.02 276.86,33.02 E8.7 276.86,38.1 276.86,45.72 | 276.86,45.72 276.86,48.26 | 276.86,48.26 C4.2 276.86,60.96 | E8.3 276.86,45.72 | E8.2 276.86,48.26 | E9.7 276.86,60.96 | SV5.49 271.78,99.06 E10.2 E10.3 276.86,91.44 276.86,83.82 | 276.86,83.82 276.86,73.66 | 276.86,73.66 276.86,71.12 | 276.86,71.12 276.86,60.96 | E10.7 276.86,83.82 | E9.3 276.86,71.12 | E9.2 276.86,73.66 | E9.11 E9.12 | 304.8,33.02 U$5.C2 | 289.56,33.02 304.8,33.02 | E15.14 106.68,45.72 | 160.02,38.1 C2.2 160.02,71.12 | E14.10 160.02,71.12 | SV3.49 157.48,99.06 160.02,96.52 160.02,71.12 | E13.10 160.02,38.1 | 160.02,38.1 U$3.C2 | U$4.C2 223.52,38.1 | 223.52,38.1 E11.10 | 223.52,38.1 C3.2 223.52,71.12 | E12.10 223.52,71.12 | SV4.49 218.44,99.06 223.52,93.98 223.52,71.12
  Top 0.813: U$1.C2 C1.2 | C1.2 E17.7 | E18.8 27.94,35.56 C1.2
  Bottom 0.711: 50.8,15.24 U$1.C2 | H02.C2 115.25,8.57 115.57,8.89 115.57,13.97 114.3,15.24 U$2.C2 | SV2.2 SV2.1 v83.82,38.1 v106.68,38.1 | SV2.50 SV2.49 | H03.C2 178.75,8.57 179.07,8.89 179.07,13.97 177.8,15.24 U$3.C2 | H04.C2 242.25,8.57 242.57,8.89 242.57,13.97 241.3,15.24 U$4.C2 | H05.C2 305.75,8.57 306.07,8.89 306.07,13.97 304.8,15.24 U$5.C2 | SV3.2 SV3.1 E13.10 | SV5.2 SV5.1 267.97,35.56 E8.7 | SV5.50 SV5.49 | E9.12 287.02,76.2 E6.4 | SV3.50 SV3.49 | SV4.50 SV4.49 | SV4.2 SV4.1 E11.10
  Bottom 0.813: H01.C2 51.75,8.57 52.07,8.89 52.07,13.97 50.8,15.24 | SV1.2 SV1.1 20.32,38.1 | 20.32,38.1 C9.2 E18.8 | 20.32,38.1 20.32,43.18 22.86,45.72 E18.5 E18.4 13.97,59.69 13.97,96.52 SV1.49 SV1.50
MBODD_P  (via drill 0.81)  (1 unrouted)
  Top 0.406: U$5.T2 256.54,27.94 v256.54,83.82 | E14.11 166.37,72.39 166.37,76.2 | 166.37,76.2 166.37,81.28 | 166.37,81.28 166.37,85.09 E14.17 | E14.15 166.37,81.28 | E14.13 166.37,76.2
  Bottom 0.406: H05.T2 264.48,8.57 264.16,8.89 U$5.T2 | SV5.42 261.62,88.9 v256.54,83.82 | SV3.42 137.16,87.63 163.83,87.63 E14.17
MCBMB00(0)  (via drill 0.81)  (1 unrouted)
  Top 0.406: U$2.S2 69.85,26.67 69.85,81.28 SV2.38 | SV3.38 137.16,82.55 139.7,82.55 144.78,77.47 v144.78,58.42
  Bottom 0.406: H02.S2 77.47,7.62 77.47,13.97 76.2,15.24 U$2.S2 | v144.78,58.42 E13.2
MCBMB01(0)  (via drill 0.81)  (1 unrouted)
  Top 0.406: SV3.35 139.7,81.28 143.51,77.47 v143.51,53.34
  Bottom 0.406: H02.T2 73.98,8.57 73.66,8.89 U$2.T2 69.85,24.13 69.85,78.74 71.12,80.01 73.66,80.01 SV2.35 | v143.51,53.34 E13.4
MCBMB02(0)  (via drill 0.81)  (1 unrouted)
  Top 0.406: SV3.36 137.16,80.01 139.7,80.01 142.24,77.47 v142.24,49.53
  Bottom 0.406: H02.V2 67.63,8.57 67.31,8.89 U$2.V2 67.31,80.01 68.58,81.28 SV2.36 | E13.6 143.51,48.26 v142.24,49.53
MCBMB03(0)
  Top 0.406: U$3.D2 171.45,24.13 166.37,24.13 156.21,34.29 156.21,41.91 E13.8
  Bottom 0.406: H03.D2 175.58,8.57 175.26,8.89 U$3.D2
MCBMB04(0)  (via drill 0.81)
  Top 0.406: U$3.E2 171.45,21.59 170.18,22.86 165.1,22.86 154.94,33.02 v154.94,36.83
  Bottom 0.406: H03.E2 172.4,8.57 172.72,8.89 172.72,13.97 171.45,15.24 U$3.E2 | v154.94,36.83 163.83,36.83 E13.11
MCBMB05(0)  (via drill 0.81)
  Top 0.406: U$3.H2 153.67,31.75 v153.67,41.91
  Bottom 0.406: H03.H2 166.05,8.57 166.37,8.89 166.37,13.97 165.1,15.24 U$3.H2 | v153.67,41.91 163.83,41.91 E13.13
MCBMB06(0)  (via drill 0.81)
  Top 0.406: U$3.K2 152.4,26.67 v152.4,46.99
  Bottom 0.406: H03.K2 159.7,8.57 160.02,8.89 160.02,13.97 158.75,15.24 U$3.K2 | v152.4,46.99 163.83,46.99 E13.15
MCBMB07(0)  (via drill 0.81)
  Top 0.406: U$3.M2 151.13,21.59 v151.13,52.07
  Bottom 0.406: H03.M2 153.35,8.57 153.67,8.89 153.67,13.97 152.4,15.24 U$3.M2 | v151.13,52.07 163.83,52.07 E13.17
MCBMB08(0)  (via drill 0.81)
  Top 0.406: U$3.P2 149.86,24.13 v149.86,91.44
  Bottom 0.406: H03.P2 147,8.57 147.32,8.89 147.32,13.97 146.05,15.24 U$3.P2 | v149.86,91.44 E14.2
MCBMB09(0)  (via drill 0.81)
  Top 0.406: U$3.S2 148.59,29.21 v148.59,86.36
  Bottom 0.406: H03.S2 140.65,8.57 140.97,8.89 140.97,13.97 139.7,15.24 U$3.S2 | v148.59,86.36 E14.4
MCBMB10(0)  (via drill 0.81)
  Top 0.406: U$3.T2 147.32,30.48 v147.32,81.28
  Bottom 0.406: H03.T2 137.16,7.62 U$3.T2 | v147.32,81.28 E14.6
MCBMB11(0)  (via drill 0.81)
  Top 0.406: U$3.V2 146.05,35.56 v146.05,76.2
  Bottom 0.406: H03.V2 131.13,8.57 130.81,8.89 U$3.V2 | v146.05,76.2 E14.8
MEM00  (via drill 0.81)
  Top 0.406: U$4.E2 218.44,36.83 v218.44,54.61
  Bottom 0.406: H04.E2 236.22,7.62 236.22,13.97 234.95,15.24 U$4.E2 | v218.44,54.61 227.33,54.61 E11.18
MEM01  (via drill 0.81)
  Top 0.406: U$4.H2 217.17,31.75 v217.17,49.53
  Bottom 0.406: H04.H2 229.87,7.62 229.87,13.97 228.6,15.24 U$4.H2 | v217.17,49.53 227.33,49.53 E11.16
MEM02  (via drill 0.81)
  Top 0.406: U$4.K2 215.9,26.67 v215.9,44.45
  Bottom 0.406: H04.K2 223.2,8.57 223.52,8.89 223.52,13.97 222.25,15.24 U$4.K2 | v215.9,44.45 227.33,44.45 E11.14
MEM03  (via drill 0.81)
  Top 0.406: U$4.M2 214.63,21.59 v214.63,39.37
  Bottom 0.406: H04.M2 216.85,8.57 217.17,8.89 217.17,13.97 215.9,15.24 U$4.M2 | v214.63,39.37 227.33,39.37 E11.12
MEM04  (via drill 0.81)
  Top 0.406: U$4.P2 213.36,24.13 v213.36,40.64
  Bottom 0.406: H04.P2 210.5,8.57 210.82,8.89 210.82,13.97 209.55,15.24 U$4.P2 | v213.36,40.64 E11.9
MEM05  (via drill 0.81)
  Top 0.406: U$4.S2 212.09,29.21 v212.09,45.72
  Bottom 0.406: H04.S2 204.15,8.57 204.47,8.89 204.47,13.97 203.2,15.24 U$4.S2 | v212.09,45.72 E11.7
MEM06  (via drill 0.81)
  Top 0.406: U$4.T2 210.82,30.48 v210.82,50.8
  Bottom 0.406: H04.T2 200.98,8.57 200.66,8.89 U$4.T2 | v210.82,50.8 E11.5
MEM07  (via drill 0.81)
  Top 0.406: U$4.V2 209.55,35.56 v209.55,55.88
  Bottom 0.406: H04.V2 194.31,7.62 U$4.V2 | v209.55,55.88 E11.3
MEM08  (via drill 0.81)  (1 unrouted)
  Top 0.406: U$5.D2 290.83,31.75 274.32,31.75 273.05,33.02 v273.05,85.09
  Bottom 0.406: H05.D2 302.58,8.57 302.26,8.89 U$5.D2 | E12.18 227.33,87.63 203.2,87.63 SV4.41 | v273.05,85.09 269.24,88.9 SV5.41
MEM09  (via drill 0.81)  (1 unrouted)
  Top 0.406: U$5.E2 288.29,30.48 274.32,30.48 271.78,33.02 v271.78,83.82
  Bottom 0.406: H05.E2 299.4,8.57 299.72,8.89 299.72,13.97 298.45,15.24 U$5.E2 | v271.78,83.82 269.24,86.36 SV5.39 | E12.16 227.33,82.55 207.01,82.55 203.2,86.36 SV4.39
MEM10  (via drill 0.81)  (1 unrouted)
  Top 0.406: U$5.H2 283.21,29.21 274.32,29.21 270.51,33.02 v270.51,82.55
  Bottom 0.406: H05.H2 293.05,8.57 293.37,8.89 293.37,13.97 292.1,15.24 U$5.H2 | v270.51,82.55 267.97,85.09 264.16,85.09 SV5.40 | E12.14 227.33,77.47 209.55,77.47 204.47,82.55 204.47,83.82 203.2,85.09 200.66,85.09 SV4.40
MEM11  (via drill 0.81)  (1 unrouted)
  Top 0.406: U$5.K2 278.13,27.94 274.32,27.94 269.24,33.02 v269.24,81.28
  Bottom 0.406: H05.K2 286.7,8.57 287.02,8.89 287.02,13.97 285.75,15.24 U$5.K2 | v269.24,81.28 266.7,83.82 SV5.37 | E12.12 227.33,74.93 210.82,74.93 SV4.37
MEM_P
  Top 0.406: U$4.D2 223.52,35.56 220.98,35.56 219.71,36.83 219.71,72.39 E12.9
  Bottom 0.406: H04.D2 239.08,9.84 238.76,10.16 U$4.D2
MEMDONE(1)  (via drill 0.81)
  Top 0.406: U$5.S2 257.81,29.21 v257.81,39.37
  Bottom 0.406: H05.S2 267.65,8.57 267.97,8.89 267.97,13.97 266.7,15.24 U$5.S2 | v257.81,39.37 273.05,39.37 E8.5
MEMSTART(0)  (via drill 0.81)
  Top 0.406: U$5.M2 276.86,22.86 273.05,22.86 260.35,35.56 260.35,63.5 259.08,64.77 v259.08,97.79
  Bottom 0.406: H05.M2 280.35,8.57 280.67,8.89 280.67,13.97 279.4,15.24 U$5.M2 | v259.08,97.79 302.26,97.79 E3.1
MS100
  Bottom 0.406: E10.11 284.48,91.44 288.29,95.25 302.26,95.25 E3.2
MS150
  Bottom 0.406: E10.4 275.59,90.17 292.1,90.17 294.64,92.71 309.88,92.71 E3.6
MS250
  Bottom 0.406: E2.1 E3.5
MS350
  Bottom 0.406: E2.2 300.99,81.28 299.72,82.55 294.64,82.55 292.1,80.01 280.67,80.01 276.86,76.2 276.86,71.12 E9.4
MS400
  Bottom 0.406: E9.1 280.67,82.55 292.1,82.55 294.64,85.09 298.45,85.09 300.99,82.55 307.34,82.55 E2.6
MS500
  Bottom 0.406: E1.1 E2.5
MS650
  Bottom 0.406: E1.6 312.42,64.77 312.42,100.33 311.15,101.6 276.86,101.6 E10.1
N$1
  Bottom 0.406: H01.L2 29.53,8.57 29.21,8.89 U$1.L2
N$3
  Bottom 0.406: H01.N2 23.18,8.57 22.86,8.89 U$1.N2
N$5
  Bottom 0.406: H01.R2 16.83,8.57 16.51,8.89 U$1.R2
N$7
  Bottom 0.406: H02.L2 93.03,8.57 92.71,8.89 U$2.L2
N$8
  Bottom 0.406: H02.N2 86.68,8.57 86.36,8.89 U$2.N2
N$9
  Bottom 0.406: H01.J2 35.88,8.57 35.56,8.89 U$1.J2
N$10
  Bottom 0.406: H02.R2 80.33,8.57 80.01,8.89 U$2.R2
N$11
  Bottom 0.406: H01.F2 42.23,8.57 41.91,8.89 U$1.F2
N$12
  Bottom 0.406: H02.J2 99.38,8.57 99.06,8.89 U$2.J2
N$13
  Bottom 0.406: H02.F2 105.41,7.62 U$2.F2
N$14
  Bottom 0.406: H02.U2 70.8,8.57 71.12,8.89 71.12,13.97 69.85,15.24 U$2.U2
N$15
  Bottom 0.406: U$1.U2 6.35,15.24 7.62,13.97 7.62,8.89 7.3,8.57 H01.U2
N$16
  Bottom 0.406: H02.B2 118.43,8.57 118.11,8.89 U$2.B2
N$17
  Bottom 0.406: H01.B2 54.93,8.57 54.61,8.89 U$1.B2
N$18
  Bottom 0.406: E18.15 35.56,55.88 FIELDS.1
N$19
  Bottom 0.406: E18.14 35.56,53.34 FIELDS.3
N$20
  Bottom 0.406: E18.13 35.56,50.8 FIELDS.5
N$21
  Bottom 0.406: E18.12 35.56,48.26 FIELDS.7
N$22
  Bottom 0.406: E18.11 35.56,45.72 FIELDS.9
N$23
  Bottom 0.406: E18.10 35.56,43.18 FIELDS.11
N$24
  Bottom 0.406: E18.9 35.56,40.64 FIELDS.13
N$25
  Bottom 0.406: FIELDS.15 35.56,38.1 33.02,35.56 27.94,40.64 E18.7
N$26
  Bottom 0.406: FIELDS.8 E17.4
N$27
  Bottom 0.406: FIELDS.6 E17.3
N$28
  Bottom 0.406: E17.2 FIELDS.4
N$29
  Bottom 0.406: FIELDS.2 E17.1
N$30
  Bottom 0.406: FIELDS.10 E17.5
N$31
  Bottom 0.406: FIELDS.12 E17.6
N$32
  Bottom 0.406: FIELDS.14 44.45,41.91 52.07,41.91 54.61,44.45 54.61,46.99 E17.12
N$33
  Bottom 0.406: E17.11 55.88,45.72 55.88,43.18 50.8,38.1 FIELDS.16
N$44
  Bottom 0.406: H04.J2 226.38,8.57 226.06,8.89 U$4.J2
N$45
  Bottom 0.406: H04.L2 220.03,8.57 219.71,8.89 U$4.L2
N$46
  Bottom 0.406: H04.N2 213.68,8.57 213.36,8.89 U$4.N2
N$57
  Bottom 0.406: H03.J2 162.88,8.57 162.56,8.89 U$3.J2
N$58
  Bottom 0.406: H03.L2 156.53,8.57 156.21,8.89 U$3.L2
N$59
  Bottom 0.406: H03.N2 150.18,8.57 149.86,8.89 U$3.N2
N$60
  Bottom 0.406: H03.F2 169.23,8.57 168.91,8.89 U$3.F2
N$61
  Bottom 0.406: H03.R2 143.83,8.57 143.51,8.89 U$3.R2
N$62
  Bottom 0.406: H03.B2 181.93,8.57 181.61,8.89 U$3.B2
N$63
  Bottom 0.406: H03.U2 134.3,8.57 134.62,8.89 134.62,13.97 133.35,15.24 U$3.U2
N$87
  Bottom 0.406: H05.J2 289.88,8.57 289.56,8.89 U$5.J2
N$88
  Bottom 0.406: H05.L2 283.53,8.57 283.21,8.89 U$5.L2
N$89
  Bottom 0.406: H05.N2 277.18,8.57 276.86,8.89 U$5.N2
N$90
  Bottom 0.406: H05.F2 296.23,8.57 295.91,8.89 U$5.F2
N$91
  Bottom 0.406: H05.R2 270.83,8.57 270.51,8.89 U$5.R2
N$92
  Bottom 0.406: H05.B2 308.93,8.57 308.61,8.89 U$5.B2
N$93
  Bottom 0.406: H05.U2 261.3,8.57 261.62,8.89 261.62,13.97 260.35,15.24 U$5.U2
N$112
  Bottom 0.406: H04.F2 232.73,8.57 232.41,8.89 U$4.F2
N$113
  Bottom 0.406: H04.R2 207.33,8.57 207.01,8.89 U$4.R2
N$114
  Bottom 0.406: H04.B2 245.43,8.57 245.11,8.89 U$4.B2
N$115
  Bottom 0.406: H04.U2 197.8,8.57 198.12,8.89 198.12,13.97 196.85,15.24 U$4.U2
OE(0)  (2 unrouted)
  Top 0.406: SV5.22 264.16,64.77 266.7,64.77 266.7,83.82 269.24,86.36 E10.6
  Bottom 0.406: E15.22 118.11,64.77 101.6,64.77 100.33,63.5 E16.22 86.36,63.5 85.09,64.77 73.66,64.77 SV2.22 | E12.1 226.06,93.98 E12.19 229.87,90.17 229.87,59.69 E11.19 226.06,60.96 E11.1 219.71,62.23 200.66,62.23 SV4.22
PARITY  (via drill 0.81)  (2 unrouted)
  Top 0.406: SV3.3 137.16,41.91 130.81,41.91 129.54,43.18 v129.54,72.39 | SV4.3 203.2,40.64 208.28,45.72 208.28,60.96 v215.9,68.58 | E12.11 229.87,72.39 229.87,76.2 | 229.87,76.2 229.87,81.28 | 229.87,81.28 229.87,85.09 E12.17 | E12.15 229.87,81.28 | E12.13 229.87,76.2
  Bottom 0.406: E15.16 111.76,40.64 SV2.3 | E14.9 156.21,72.39 v129.54,72.39 | v215.9,68.58 226.06,68.58 E12.11
STROBE(0)  (via drill 0.81)
  Top 0.406: U$5.P2 259.08,34.29 v259.08,62.23
  Bottom 0.406: H05.P2 274,8.57 274.32,8.89 274.32,13.97 273.05,15.24 U$5.P2 | v259.08,62.23 273.05,62.23 E9.6
TP150  (via drill 0.81)
  Top 0.406: v299.72,77.47 299.72,91.44 E7.6
  Bottom 0.406: E9.10 284.48,66.04 295.91,77.47 v299.72,77.47
TP250
  Bottom 0.406: E7.5 E6.1
TP300
  Bottom 0.406: E9.13 285.75,77.47 293.37,77.47 E6.7
TP500  (via drill 0.81)
  Top 0.406: v284.48,93.98 v284.48,60.96
  Bottom 0.406: E6.5 E5.1 284.48,63.5 v284.48,60.96 281.94,58.42 274.32,58.42 273.05,57.15 273.05,44.45 E8.4 | E10.13 v284.48,93.98
TP550
  Bottom 0.406: E8.1 276.86,53.34 284.48,53.34 E5.7
VCC  (4 unrouted)
  Top 0.711: U$5.A2 C6.1 308.61,58.42 308.61,68.58 | E4.14 C5.1 294.64,58.42 294.64,68.58 | E8.14 C4.1 279.4,58.42 279.4,76.2 | E5.8 294.64,68.58 | 308.61,68.58 E1.8 | 294.64,83.82 294.64,96.52 E7.8 297.18,101.6 | 294.64,83.82 294.64,68.58 | E6.8 294.64,83.82 | 308.61,83.82 308.61,96.52 E3.8 308.61,101.6 297.18,101.6 | 308.61,83.82 308.61,68.58 | E2.8 308.61,83.82 | E9.14 279.4,76.2 | 279.4,88.9 279.4,96.52 E10.14 284.48,101.6 297.18,101.6 | 279.4,88.9 279.4,76.2 | E10.10 279.4,88.9 | U$2.A2 111.76,29.21 C8.1 C7.1 111.76,71.12 E15.28 | E14.20 162.56,91.44 162.56,68.58 C2.1 E13.20 184.15,41.91 U$3.A2 | E12.20 226.06,91.44 226.06,68.58 C3.1 E11.20 247.65,41.91 U$4.A2
  Top 0.813: U$1.A2 55.88,21.59 C1.1 55.88,53.34 E17.14 55.88,58.42 35.56,58.42 E18.16
  Bottom 0.711: 57.15,15.24 U$1.A2 | H02.A2 121.92,7.62 121.92,13.97 120.65,15.24 U$2.A2 | H03.A2 185.1,8.57 185.42,8.89 185.42,13.97 184.15,15.24 U$3.A2 | H04.A2 248.6,8.57 248.92,8.89 248.92,13.97 247.65,15.24 U$4.A2 | H05.A2 312.1,8.57 312.42,8.89 312.42,13.97 311.15,15.24 U$5.A2 | E16.28 101.6,81.28 116.84,81.28 E15.28 | E18.6 C9.1
  Bottom 0.813: H01.A2 58.1,9.84 58.42,10.16 58.42,13.97 57.15,15.24 | E18.6 29.21,46.99 29.21,52.07 E18.16
WE(0)  (via drill 0.81)  (2 unrouted)
  Top 0.406: SV3.32 137.16,74.93 139.7,74.93 140.97,73.66 v140.97,60.96
  Bottom 0.406: E15.27 118.11,77.47 101.6,77.47 100.33,76.2 E16.27 86.36,76.2 85.09,77.47 73.66,77.47 SV2.32 | E14.1 162.56,93.98 E14.19 166.37,90.17 166.37,59.69 E13.19 162.56,58.42 160.02,60.96 E13.1 v140.97,60.96 | E9.8 278.13,64.77 261.62,64.77 260.35,66.04 260.35,73.66 SV5.32

### Text on the board
Top: 8i H01 | 8i H02 | 8i H03 | 8i H04 | 8i H05 | 12 H20 | 12 H21 | 12 H22 | 12 H23 | 12 H24
Bottom: 8i H01 | 8i H02 | 8i H03 | 8i H04 | 8i H05 | 12 H20 | 12 H21 | 12 H22 | 12 H23 | 12 H24
tValues: 8i H01 | 8i H02 | 8i H03 | 8i H04 | 8i H05 | 12 H20 | 12 H21 | 12 H22 | 12 H23 | 12 H24